# Altium project 8SoundsUSB.PrjPCB (part 1 of 2)
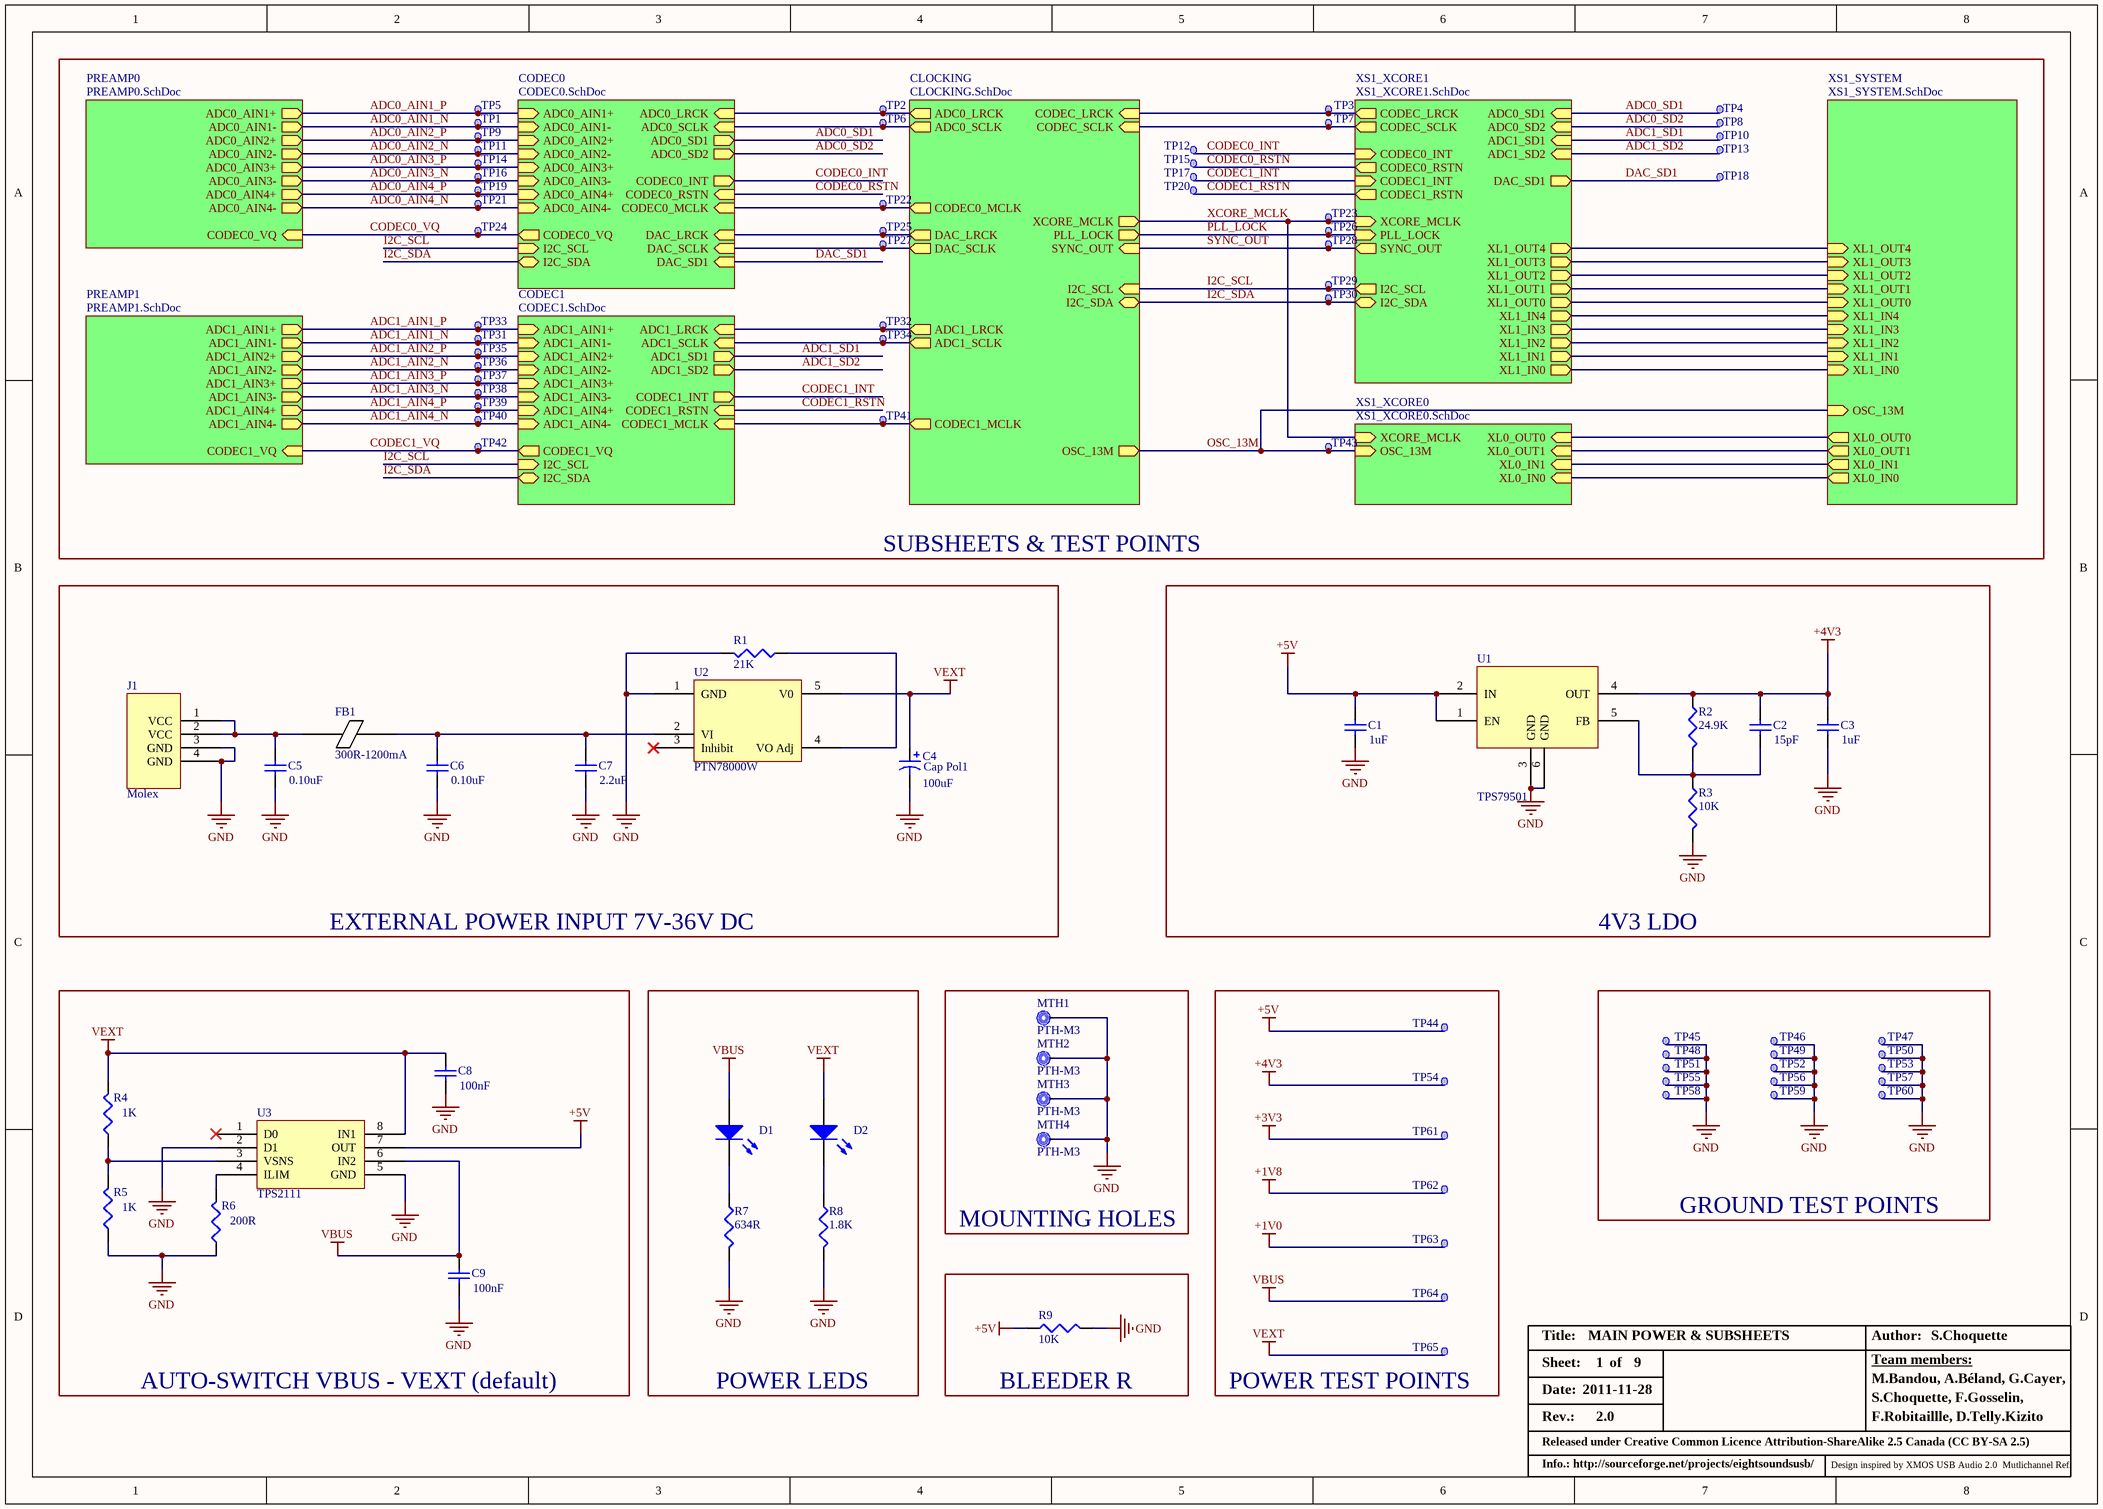
[diagram p0: MAIN_POWER.SchDoc]
9 sheets, 415 parts. Net scope: hierarchical (ports join the sheet entries above them; power ports are global).
Board file: 8SoundsUSB.PcbDoc
Sheets:
  MAIN_POWER.SchDoc
    CLOCKING = CLOCKING.SchDoc
    CODEC0 = CODEC0.SchDoc
    CODEC1 = CODEC1.SchDoc
    PREAMP0 = PREAMP0.SchDoc
    PREAMP1 = PREAMP1.SchDoc
    XS1_SYSTEM = XS1_SYSTEM.SchDoc
    XS1_XCORE0 = XS1_XCORE0.SchDoc
    XS1_XCORE1 = XS1_XCORE1.SchDoc

## Sheet MAIN_POWER.SchDoc: MAIN POWER & SUBSHEETS
size A3; Date: 2011-11-28; Author: S.Choquette; Revision: 2.0; SheetNumber: 1; SheetTotal: 9

### Parts
C1  value 1uF  [3-0603]
C2  value 15pF  [3-0603]
C3  value 1uF  [3-0603]
C4  Cap Pol1  value 100uF  [AL_ELEC_SMD_D]
C5  value 0.10uF  [3-0603]
C6  value 0.10uF  [3-0603]
C7  value 2.2uF  [8-1206]
C8  value 100nF  [3-0603]
C9  value 100nF  [3-0603]
D1  VBUS  [LED_0603]  (value not drawn)
D2  VEXT  [LED_0603]  (value not drawn)
FB1  300R-1200mA  [3-0603]
J1  Molex  [MOLEX-P4]
MTH1  PTH-M3  [Mounting Hole]
MTH2  PTH-M3  [Mounting Hole]
MTH3  PTH-M3  [Mounting Hole]
MTH4  PTH-M3  [Mounting Hole]
R1  value 21K  [3-0603]
R2  value 24.9K  [3-0603]
R3  value 10K  [3-0603]
R4  value 1K  [3-0603]
R5  value 1K  [3-0603]
R6  value 200R  [3-0603]
R7  value 634R  [3-0603]
R8  value 1.8K  [3-0603]
R9  value 10K  [3-0603]
TP1  TP  [TP]  (value not drawn)
TP2  TP  [TP]  (value not drawn)
TP3  TP  [TP]  (value not drawn)
TP4  TP  [TP]  (value not drawn)
TP5  TP  [TP]  (value not drawn)
TP6  TP  [TP]  (value not drawn)
TP7  TP  [TP]  (value not drawn)
TP8  TP  [TP]  (value not drawn)
TP9  TP  [TP]  (value not drawn)
TP10  TP  [TP]  (value not drawn)
TP11  TP  [TP]  (value not drawn)
TP12  TP  [TP]  (value not drawn)
TP13  TP  [TP]  (value not drawn)
TP14  TP  [TP]  (value not drawn)
TP15  TP  [TP]  (value not drawn)
TP16  TP  [TP]  (value not drawn)
TP17  TP  [TP]  (value not drawn)
TP18  TP  [TP]  (value not drawn)
TP19  TP  [TP]  (value not drawn)
TP20  TP  [TP]  (value not drawn)
TP21  TP  [TP]  (value not drawn)
TP22  TP  [TP]  (value not drawn)
TP23  TP  [TP]  (value not drawn)
TP24  TP  [TP]  (value not drawn)
TP25  TP  [TP]  (value not drawn)
TP26  TP  [TP]  (value not drawn)
TP27  TP  [TP]  (value not drawn)
TP28  TP  [TP]  (value not drawn)
TP29  TP  [TP]  (value not drawn)
TP30  TP  [TP]  (value not drawn)
TP31  TP  [TP]  (value not drawn)
TP32  TP  [TP]  (value not drawn)
TP33  TP  [TP]  (value not drawn)
TP34  TP  [TP]  (value not drawn)
TP35  TP  [TP]  (value not drawn)
TP36  TP  [TP]  (value not drawn)
TP37  TP  [TP]  (value not drawn)
TP38  TP  [TP]  (value not drawn)
TP39  TP  [TP]  (value not drawn)
TP40  TP  [TP]  (value not drawn)
TP41  TP  [TP]  (value not drawn)
TP42  TP  [TP]  (value not drawn)
TP43  TP  [TP]  (value not drawn)
TP44  TP  [TP]  (value not drawn)
TP45  TP  [TP]  (value not drawn)
TP46  TP  [TP]  (value not drawn)
TP47  TP  [TP]  (value not drawn)
TP48  TP  [TP]  (value not drawn)
TP49  TP  [TP]  (value not drawn)
TP50  TP  [TP]  (value not drawn)
TP51  TP  [TP]  (value not drawn)
TP52  TP  [TP]  (value not drawn)
TP53  TP  [TP]  (value not drawn)
TP54  TP  [TP]  (value not drawn)
TP55  TP  [TP]  (value not drawn)
TP56  TP  [TP]  (value not drawn)
TP57  TP  [TP]  (value not drawn)
TP58  TP  [TP]  (value not drawn)
TP59  TP  [TP]  (value not drawn)
TP60  TP  [TP]  (value not drawn)
TP61  TP  [TP]  (value not drawn)
TP62  TP  [TP]  (value not drawn)
TP63  TP  [TP]  (value not drawn)
TP64  TP  [TP]  (value not drawn)
TP65  TP  [TP]  (value not drawn)
U1  TPS79501  [SOT223-6L]
U2  PTN78000W  [PTN78000W]
U3  TPS2111  [TSOP65P640-8AL]

### Blocks framed on the sheet
SUBSHEETS & TEST POINTS: TP1-TP43
EXTERNAL POWER INPUT 7V-36V DC: C4-C7 FB1 J1 R1 U2
4V3 LDO: C1-C3 R2 R3 U1
AUTO-SWITCH VBUS - VEXT (default): C8 C9 R4-R6 U3
POWER LEDS: D1 D2 R7 R8
MOUNTING HOLES: MTH1-MTH4
POWER TEST POINTS: TP44 TP54 TP61-TP65
GROUND TEST POINTS: TP45-TP53 TP55-TP60
BLEEDER R: R9

### Sub-sheets
CLOCKING = CLOCKING.SchDoc: SYNC_OUT (in), CODEC0_MCLK (out), CODEC1_MCLK (out), I2C_SCL (in), I2C_SDA (bidir), PLL_LOCK (out), OSC_13M (out), CODEC_LRCK (in), CODEC_SCLK (in), ADC0_SCLK (out), ADC0_LRCK (out), DAC_SCLK (out), DAC_LRCK (out), XCORE_MCLK (out), ADC1_LRCK (out), ADC1_SCLK (out)
CODEC0 = CODEC0.SchDoc: ADC0_AIN1+ (in), ADC0_AIN1- (in), ADC0_AIN2+ (in), ADC0_AIN2- (in), ADC0_AIN3+ (in), ADC0_AIN3- (in), ADC0_AIN4+ (in), ADC0_AIN4- (in), CODEC0_VQ (out), ADC0_LRCK (in), ADC0_SCLK (in), ADC0_SD1 (out), ADC0_SD2 (out), CODEC0_INT (out), CODEC0_RSTN (in), CODEC0_MCLK (in), DAC_LRCK (in), DAC_SCLK (in), DAC_SD1 (in), I2C_SCL (in), I2C_SDA
CODEC1 = CODEC1.SchDoc: ADC1_AIN1+ (in), ADC1_AIN1- (in), ADC1_AIN2+ (in), ADC1_AIN2- (in), ADC1_AIN3+ (in), ADC1_AIN3- (in), ADC1_AIN4+ (in), ADC1_AIN4- (in), CODEC1_VQ (out), ADC1_LRCK (in), ADC1_SCLK (in), ADC1_SD1 (out), ADC1_SD2 (out), CODEC1_INT (out), CODEC1_RSTN (in), CODEC1_MCLK (in), I2C_SCL (in), I2C_SDA (bidir)
PREAMP0 = PREAMP0.SchDoc: ADC0_AIN1+ (out), ADC0_AIN1- (out), ADC0_AIN2+ (out), ADC0_AIN2- (out), ADC0_AIN3+ (out), ADC0_AIN3- (out), ADC0_AIN4+ (out), ADC0_AIN4- (out), CODEC0_VQ (in)
PREAMP1 = PREAMP1.SchDoc: ADC1_AIN1+ (out), ADC1_AIN1- (out), ADC1_AIN2+ (out), ADC1_AIN2- (out), ADC1_AIN3+ (out), ADC1_AIN3- (out), ADC1_AIN4+ (out), ADC1_AIN4- (out), CODEC1_VQ (in)
XS1_SYSTEM = XS1_SYSTEM.SchDoc: XL0_OUT1 (out), XL0_OUT0 (out), XL0_IN0 (out), XL0_IN1 (out), XL1_OUT4 (in), XL1_OUT3 (in), XL1_OUT2 (in), XL1_OUT1 (in), XL1_OUT0 (in), XL1_IN4 (in), XL1_IN3 (in), XL1_IN2 (in), XL1_IN1 (in), XL1_IN0 (in), OSC_13M (in)
XS1_XCORE0 = XS1_XCORE0.SchDoc: XL0_IN0 (in), XL0_IN1 (in), XL0_OUT1 (in), XL0_OUT0 (in), OSC_13M (in), XCORE_MCLK (in)
XS1_XCORE1 = XS1_XCORE1.SchDoc: CODEC_LRCK (out), CODEC_SCLK (out), CODEC0_INT (in), CODEC0_RSTN (out), CODEC1_INT (in), CODEC1_RSTN (out), XCORE_MCLK (in), PLL_LOCK (in), SYNC_OUT (out), ADC0_SD1 (in), ADC0_SD2 (in), ADC1_SD1 (in), ADC1_SD2 (in), DAC_SD1 (out), I2C_SCL (out), I2C_SDA (bidir), XL1_OUT4 (out), XL1_OUT3 (out), XL1_OUT2 (out), XL1_OUT1 (out), XL1_OUT0 (out), XL1_IN4 (out), XL1_IN3 (out), XL1_IN2 (out), XL1_IN1 (out), XL1_IN0 (out)

### Nets
+1V0: TP63.1
+1V8: TP62.1
+3V3: TP61.1
+4V3: C2.2 C3.2 R2.1 TP54.1 U1.4(OUT)
+5V: C1.2 R9.1 TP44.1 U1.1(EN) U1.2(IN) U3.7(OUT)
GND: C1.1 C3.1 C4.2 C5.1 C6.1 C7.1 C8.1 C9.1 J1.3(GND) J1.4(GND) MTH1.1 MTH2.1 MTH3.1 MTH4.1 R1.2 R3.2 R5.1 R6.1 R7.2 R8.2 R9.2 TP45.1 TP46.1 TP47.1 TP48.1 TP49.1 TP50.1 TP51.1 TP52.1 TP53.1 TP55.1 TP56.1 TP57.1 TP58.1 TP59.1 TP60.1 U1.3(GND) U1.6(GND) U2.1(GND) U3.2(D1) U3.5(GND)
VBUS: C9.2 D1.1(A) TP64.1 U3.6(IN2)
VEXT: C4.1 C8.2 D2.1(A) R4.2 TP65.1 U2.5(V0) U3.8(IN1)
ADC0_AIN1_N: TP1.1 ; sheet CODEC0/ADC0_AIN1-, sheet PREAMP0/ADC0_AIN1-
ADC0_AIN1_P: TP5.1 ; sheet CODEC0/ADC0_AIN1+, sheet PREAMP0/ADC0_AIN1+
ADC0_AIN2_N: TP11.1 ; sheet CODEC0/ADC0_AIN2-, sheet PREAMP0/ADC0_AIN2-
ADC0_AIN2_P: TP9.1 ; sheet CODEC0/ADC0_AIN2+, sheet PREAMP0/ADC0_AIN2+
ADC0_AIN3_N: TP16.1 ; sheet CODEC0/ADC0_AIN3-, sheet PREAMP0/ADC0_AIN3-
ADC0_AIN3_P: TP14.1 ; sheet CODEC0/ADC0_AIN3+, sheet PREAMP0/ADC0_AIN3+
ADC0_AIN4_N: TP21.1 ; sheet CODEC0/ADC0_AIN4-, sheet PREAMP0/ADC0_AIN4-
ADC0_AIN4_P: TP19.1 ; sheet CODEC0/ADC0_AIN4+, sheet PREAMP0/ADC0_AIN4+
ADC0_SD1: TP4.1 ; sheet CODEC0/ADC0_SD1, sheet XS1_XCORE1/ADC0_SD1
ADC0_SD2: TP8.1 ; sheet CODEC0/ADC0_SD2, sheet XS1_XCORE1/ADC0_SD2
ADC1_AIN1_N: TP31.1 ; sheet CODEC1/ADC1_AIN1-, sheet PREAMP1/ADC1_AIN1-
ADC1_AIN1_P: TP33.1 ; sheet CODEC1/ADC1_AIN1+, sheet PREAMP1/ADC1_AIN1+
ADC1_AIN2_N: TP36.1 ; sheet CODEC1/ADC1_AIN2-, sheet PREAMP1/ADC1_AIN2-
ADC1_AIN2_P: TP35.1 ; sheet CODEC1/ADC1_AIN2+, sheet PREAMP1/ADC1_AIN2+
ADC1_AIN3_N: TP38.1 ; sheet CODEC1/ADC1_AIN3-, sheet PREAMP1/ADC1_AIN3-
ADC1_AIN3_P: TP37.1 ; sheet CODEC1/ADC1_AIN3+, sheet PREAMP1/ADC1_AIN3+
ADC1_AIN4_N: TP40.1 ; sheet CODEC1/ADC1_AIN4-, sheet PREAMP1/ADC1_AIN4-
ADC1_AIN4_P: TP39.1 ; sheet CODEC1/ADC1_AIN4+, sheet PREAMP1/ADC1_AIN4+
ADC1_SD1: TP10.1 ; sheet CODEC1/ADC1_SD1, sheet XS1_XCORE1/ADC1_SD1
ADC1_SD2: TP13.1 ; sheet CODEC1/ADC1_SD2, sheet XS1_XCORE1/ADC1_SD2
CODEC0_INT: TP12.1 ; sheet CODEC0/CODEC0_INT, sheet XS1_XCORE1/CODEC0_INT
CODEC0_RSTN: TP15.1 ; sheet CODEC0/CODEC0_RSTN, sheet XS1_XCORE1/CODEC0_RSTN
CODEC0_VQ: TP24.1 ; sheet CODEC0/CODEC0_VQ, sheet PREAMP0/CODEC0_VQ
CODEC1_INT: TP17.1 ; sheet CODEC1/CODEC1_INT, sheet XS1_XCORE1/CODEC1_INT
CODEC1_RSTN: TP20.1 ; sheet CODEC1/CODEC1_RSTN, sheet XS1_XCORE1/CODEC1_RSTN
CODEC1_VQ: TP42.1 ; sheet CODEC1/CODEC1_VQ, sheet PREAMP1/CODEC1_VQ
DAC_SD1: TP18.1 ; sheet CODEC0/DAC_SD1, sheet XS1_XCORE1/DAC_SD1
I2C_SCL: TP29.1 ; sheet CLOCKING/I2C_SCL, sheet CODEC0/I2C_SCL, sheet CODEC1/I2C_SCL, sheet XS1_XCORE1/I2C_SCL
I2C_SDA: TP30.1 ; sheet CLOCKING/I2C_SDA, sheet CODEC0/I2C_SDA, sheet CODEC1/I2C_SDA, sheet XS1_XCORE1/I2C_SDA
OSC_13M: TP43.1 ; sheet CLOCKING/OSC_13M, sheet XS1_SYSTEM/OSC_13M, sheet XS1_XCORE0/OSC_13M
PLL_LOCK: TP26.1 ; sheet CLOCKING/PLL_LOCK, sheet XS1_XCORE1/PLL_LOCK
SYNC_OUT: TP28.1 ; sheet CLOCKING/SYNC_OUT, sheet XS1_XCORE1/SYNC_OUT
XCORE_MCLK: TP23.1 ; sheet CLOCKING/XCORE_MCLK, sheet XS1_XCORE0/XCORE_MCLK, sheet XS1_XCORE1/XCORE_MCLK
XL0_IN0: sheet XS1_SYSTEM/XL0_IN0, sheet XS1_XCORE0/XL0_IN0
XL0_IN1: sheet XS1_SYSTEM/XL0_IN1, sheet XS1_XCORE0/XL0_IN1
XL0_OUT0: sheet XS1_SYSTEM/XL0_OUT0, sheet XS1_XCORE0/XL0_OUT0
XL0_OUT1: sheet XS1_SYSTEM/XL0_OUT1, sheet XS1_XCORE0/XL0_OUT1
NetC2_1: C2.1 R2.2 R3.1 U1.5(FB)
NetC5_2: C5.2 FB1.2 J1.1(VCC) J1.2(VCC)
NetC6_2: C6.2 C7.2 FB1.1 U2.2(VI)
NetD1_2: D1.2(K) R7.1
NetD2_2: D2.2(K) R8.1
NetJ3_2: sheet XS1_SYSTEM/XL1_OUT4, sheet XS1_XCORE1/XL1_OUT4
NetJ3_4: sheet XS1_SYSTEM/XL1_OUT3, sheet XS1_XCORE1/XL1_OUT3
NetJ3_6: sheet XS1_SYSTEM/XL1_OUT1, sheet XS1_XCORE1/XL1_OUT1
NetJ3_8: sheet XS1_SYSTEM/XL1_OUT2, sheet XS1_XCORE1/XL1_OUT2
NetJ3_10: sheet XS1_SYSTEM/XL1_OUT0, sheet XS1_XCORE1/XL1_OUT0
NetJ3_12: sheet XS1_SYSTEM/XL1_IN2, sheet XS1_XCORE1/XL1_IN2
NetJ3_14: sheet XS1_SYSTEM/XL1_IN0, sheet XS1_XCORE1/XL1_IN0
NetJ3_16: sheet XS1_SYSTEM/XL1_IN3, sheet XS1_XCORE1/XL1_IN3
NetJ3_18: sheet XS1_SYSTEM/XL1_IN1, sheet XS1_XCORE1/XL1_IN1
NetJ3_20: sheet XS1_SYSTEM/XL1_IN4, sheet XS1_XCORE1/XL1_IN4
NetR1_1: R1.1 U2.4(VO_Adj)
NetR4_1: R4.1 R5.2 U3.3(VSNS)
NetR6_2: R6.2 U3.4(ILIM)
NetR42_1: TP22.1 ; sheet CLOCKING/CODEC0_MCLK, sheet CODEC0/CODEC0_MCLK
NetR43_1: TP41.1 ; sheet CLOCKING/CODEC1_MCLK, sheet CODEC1/CODEC1_MCLK
NetR46_1: TP6.1 ; sheet CLOCKING/ADC0_SCLK, sheet CODEC0/ADC0_SCLK
NetR47_1: TP34.1 ; sheet CLOCKING/ADC1_SCLK, sheet CODEC1/ADC1_SCLK
NetR48_1: TP27.1 ; sheet CLOCKING/DAC_SCLK, sheet CODEC0/DAC_SCLK
NetR49_1: TP2.1 ; sheet CLOCKING/ADC0_LRCK, sheet CODEC0/ADC0_LRCK
NetR50_1: TP32.1 ; sheet CLOCKING/ADC1_LRCK, sheet CODEC1/ADC1_LRCK
NetR51_1: TP25.1 ; sheet CLOCKING/DAC_LRCK, sheet CODEC0/DAC_LRCK
NetTP3_1: TP3.1 ; sheet CLOCKING/CODEC_LRCK, sheet XS1_XCORE1/CODEC_LRCK
NetTP7_1: TP7.1 ; sheet CLOCKING/CODEC_SCLK, sheet XS1_XCORE1/CODEC_SCLK

Not connected (* = marked no-connect by the designer): U2 3(Inhibit)*; U3 1(D0)*

### Notes on the sheet
- Title:
- Date:
- Sheet:
- of
- Author:
- Team members:
- M.Bandou, A.Béland, G.Cayer,
- Rev.:
- Released under Creative Common Licence Attribution-ShareAlike 2.5 Canada (CC BY-SA 2.5)
- S.Choquette, F.Gosselin,
- F.Robitaillle, D.Telly.Kizito
- Info.: http://sourceforge.net/projects/eightsoundsusb/
- Design inspired by XMOS USB Audio 2.0  Mutlichannel Ref.

### Library data of the parts
C1 C3 = Cap: MLCC 1uF 0603 X5R 10V; Manufacturer: Murata; Part Number: GRM188R61A105KA61; Cost: 0,005
C2 = Cap: MLCC 15pF 0603 C0G 50V; Manufacturer: Murata; Part Number: GRM1885C1H150JA01D; Cost: 0,005
C4 = Cap Pol1: Al Elec 100uF CaseD 16V; Manufacturer: Panasonic; Part Number: EEEFK1C101P; Cost: *
C5 C6 = Cap: MLCC 0.10uF 0603 X7R 50V; Manufacturer: Murata; Part Number: GRM188R71H104KA93D; Cost: 0,005
C7 = Cap: MLCC 2.2uF 1206 X7R 50V; Manufacturer: Murata; Part Number: GRM31CR71H225KA88L
C8 C9 = Cap: MLCC 100nF 0603 X7R 16V; Manufacturer: Murata; Part Number: GRM188R71C104KA01; Cost: 0,005
D1 D2 = LED2: LED, GREEN, 0603; Manufacturer: Kingbright; Part Number: APT1608CGCK; Publisher: Altium Limited
FB1 = 300R-1200mA: Ferrite 300R -1200mA; Part Number: BLM18SG331TN1D; Manufacturer: Murata
J1 = Component_1: Molex connector; Part Number: 0026013115; Manufacturer: Molex
MTH1-MTH4 = MountingHole
R1 = Res3: RES 21k 0603 1%; Manufacturer: ROHM; PArt Number: MCR03EZPFX2102; Cost: *
R2 = Res3: RES 24.9K 0603 1%; Manufacturer: ROHM; Part Number: MCR03EZPFX2493; Cost: *
R3 R9 = Res3: RES 10k 0603 1%; Manufacturer: ROHM; Part Number: MCR03EZPFX1002; Cost: *
R4 R5 = Res3: RES 1k 0603 1%; Manufacturer: ROHM; Part Number: MCR03EZPFX1001; Cost: *
R6 = Res3: RES 200R 0603 1%; Manufacturer: ROHM; PArt Number: MCR03EZPFX2000; Cost: *
R7 = Res3: RES 634R 0603 1%; Manufacturer: ROHM; Part Number: MCR03EZPFX6340; Cost: *
R8 = Res3: RES 1.8k 0603 1%; Manufacturer: ROHM; Part Number: MCR03EZPFX1801; Cost: *
U1 = TPS79501: ULTRALOW-NOISE, HIGH PSRR, FAST RF 500-mA LOW-DROPOUT LINEAR REGULATORS; Manufacturer: Texas instruments; Part Number: TPS79501DCQ
U2 = PTN78000: 1.5-A, Wide-Input Adjustable Switching Regulator; Manufacturer: Texas Instrument; Part Number: PTN78000W; Cost: *
U3 = TPS2111: Dual In/Single Out Autoswitching Power MUX; Manufacturer: Texas Instrument; Part Number: TPS2111; Cost: *

## Sheet CLOCKING.SchDoc: CLOCKING
size A3; Date: 2011-11-28; Author: S.Choquette; Revision: 2.0; SheetNumber: 5; SheetTotal: 9
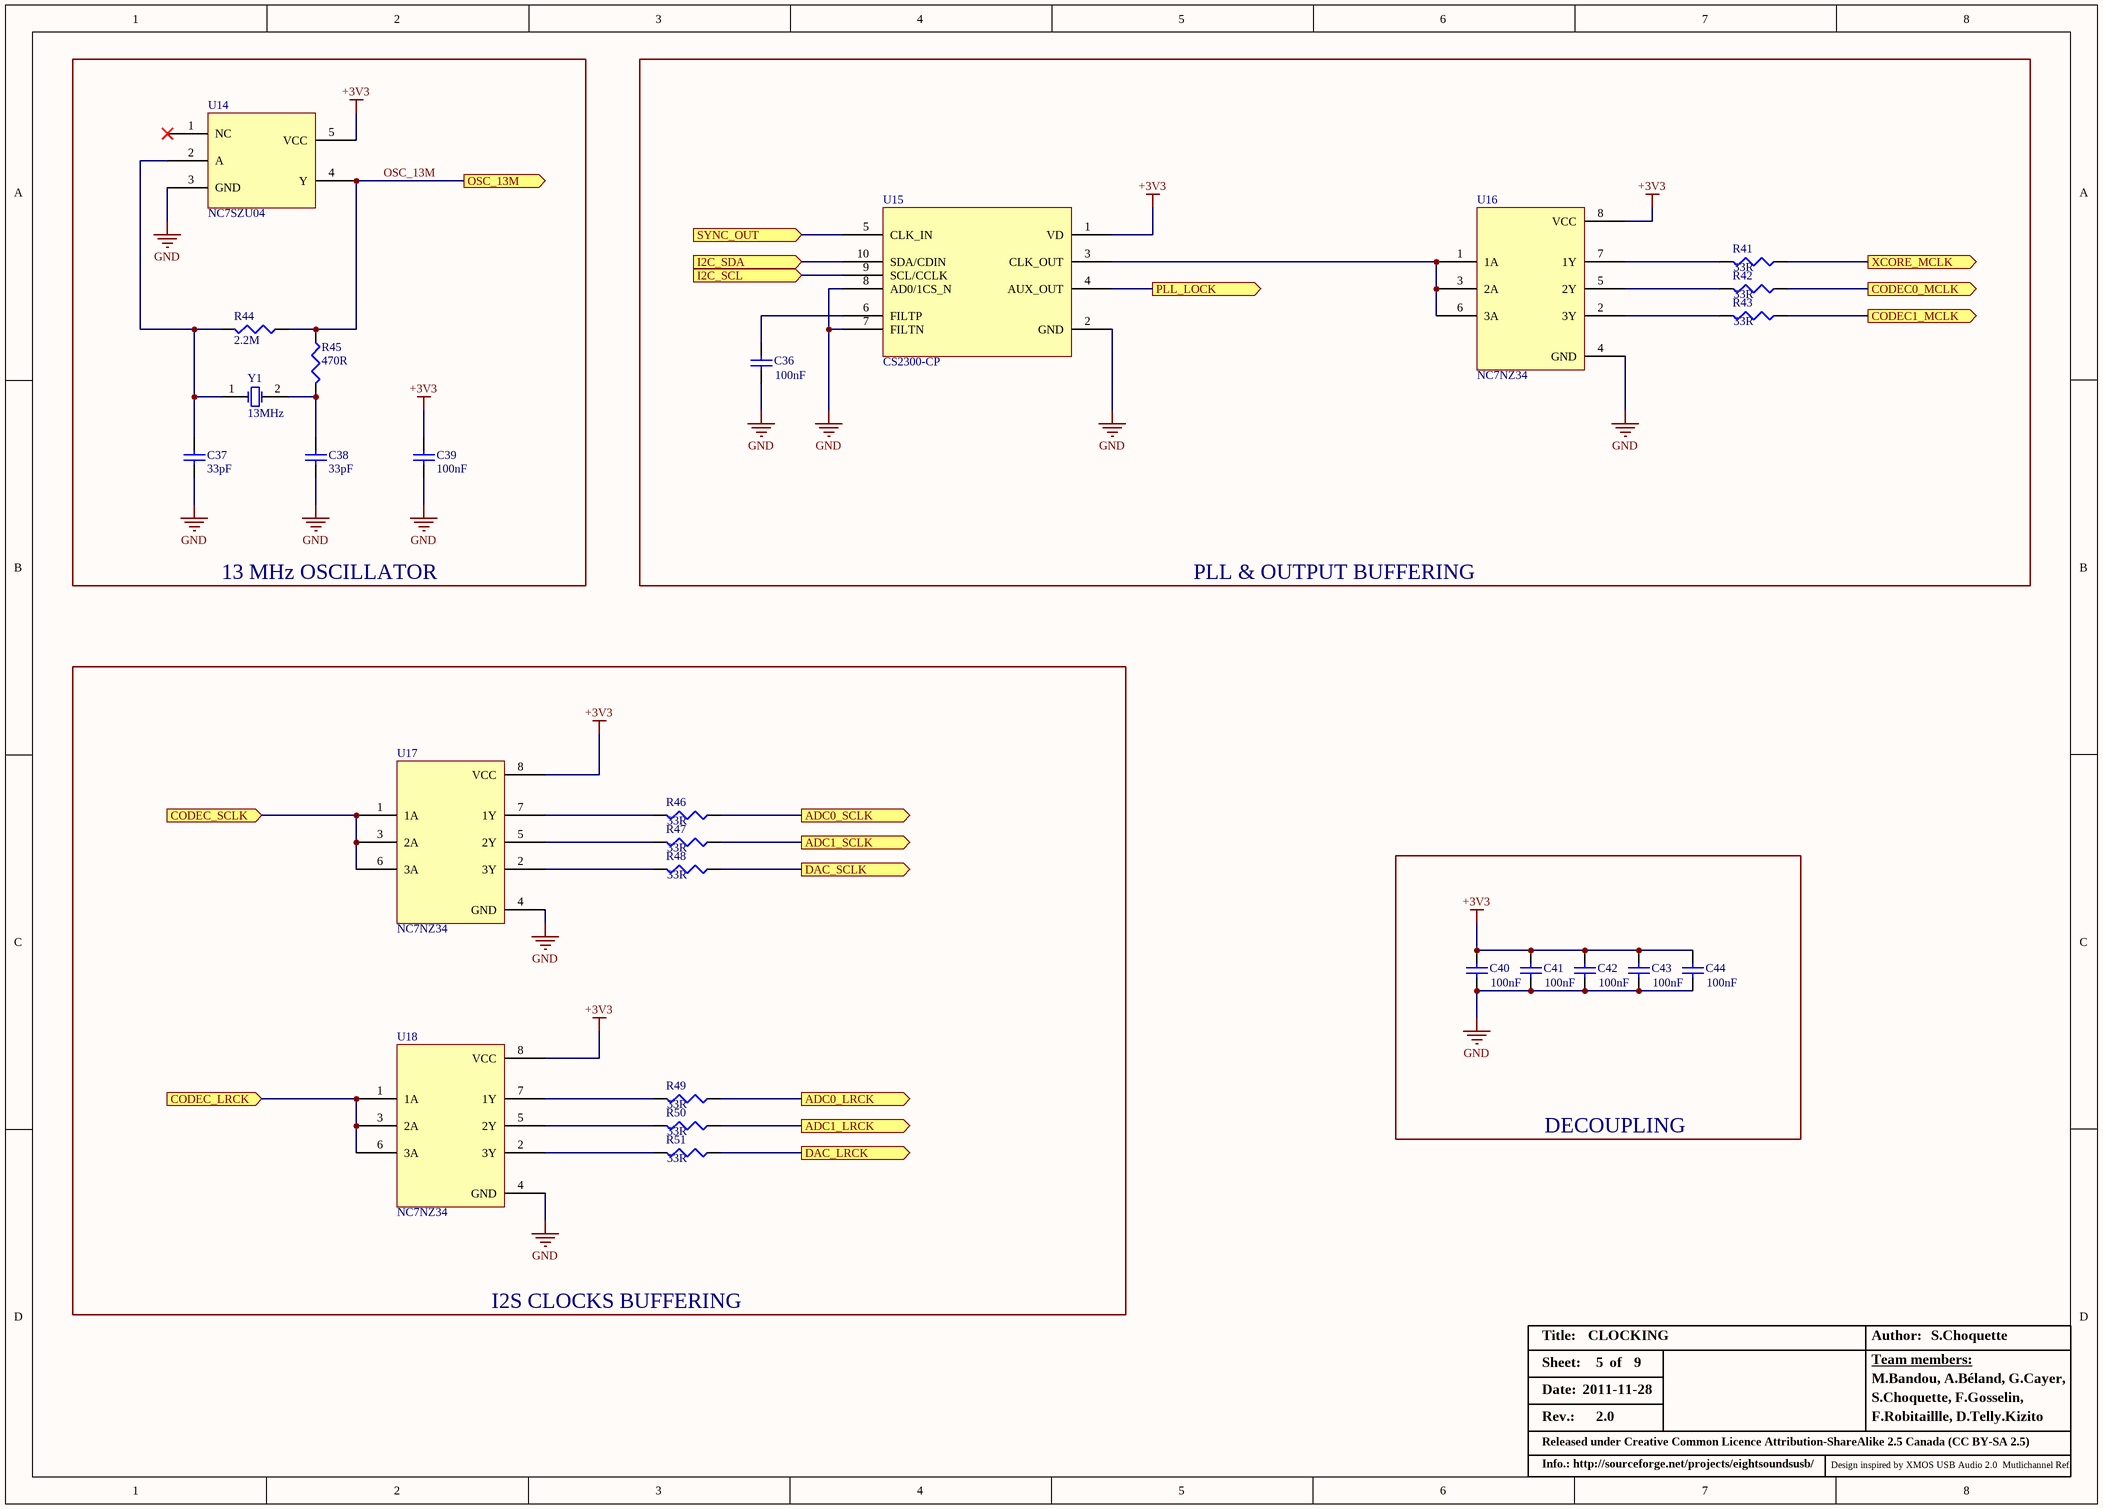
[diagram p1: CLOCKING.SchDoc]

### Parts
C36  value 100nF  [2-0402]
C37  value 33pF  [3-0603]
C38  value 33pF  [3-0603]
C39  value 100nF  [3-0603]
C40  value 100nF  [2-0402]
C41  value 100nF  [2-0402]
C42  value 100nF  [2-0402]
C43  value 100nF  [2-0402]
C44  value 100nF  [2-0402]
R41  value 33R  [3-0603]
R42  value 33R  [3-0603]
R43  value 33R  [3-0603]
R44  value 2.2M  [3-0603]
R45  value 470R  [3-0603]
R46  value 33R  [3-0603]
R47  value 33R  [3-0603]
R48  value 33R  [3-0603]
R49  value 33R  [3-0603]
R50  value 33R  [3-0603]
R51  value 33R  [3-0603]
U14  NC7SZU04  [SOT23-5AL_MOD(1-07-26)]
U15  CS2300-CP  [TSSOP50P490-10AL]
U16  NC7NZ34  [NC7NZ34]
U17  NC7NZ34  [NC7NZ34]
U18  NC7NZ34  [NC7NZ34]
Y1  13MHz  [X_TAL]

### Blocks framed on the sheet
13 MHz OSCILLATOR: C37-C39 R44 R45 U14 Y1
PLL & OUTPUT BUFFERING: C36 R41-R43 U15 U16
I2S CLOCKS BUFFERING: R46-R51 U17 U18
DECOUPLING: C40-C44

### Ports
ADC0_LRCK (out), ADC0_SCLK (out), ADC1_LRCK (out), ADC1_SCLK (out), CODEC0_MCLK (out), CODEC1_MCLK (out), CODEC_LRCK (in), CODEC_SCLK (in), DAC_LRCK (out), DAC_SCLK (out), I2C_SCL (in), I2C_SDA (in), OSC_13M (out), PLL_LOCK (out), SYNC_OUT (in), XCORE_MCLK (out)

### Nets
+3V3: C39.2 C40.2 C41.2 C42.2 C43.2 C44.2 U14.5(VCC) U15.1(VD) U16.8(VCC) U17.8(VCC) U18.8(VCC)
GND: C36.1 C37.1 C38.1 C39.1 C40.1 C41.1 C42.1 C43.1 C44.1 U14.3(GND) U15.2(GND) U15.7(FILTN) U15.8(AD0/1CS_N) U16.4(GND) U17.4(GND) U18.4(GND)
I2C_SCL: U15.9(SCL/CCLK) ; port I2C_SCL
I2C_SDA: U15.10(SDA/CDIN) ; port I2C_SDA
OSC_13M: R44.1 R45.1 U14.4(Y) ; port OSC_13M
PLL_LOCK: U15.4(AUX_OUT) ; port PLL_LOCK
SYNC_OUT: U15.5(CLK_IN) ; port SYNC_OUT
XCORE_MCLK: R41.1 ; port XCORE_MCLK
NetC36_2: C36.2 U15.6(FILTP)
NetC37_2: C37.2 R44.2 U14.2(A) Y1.1(OSC1)
NetC38_2: C38.2 R45.2 Y1.2(OSC2)
NetR41_2: R41.2 U16.7(1Y)
NetR42_1: R42.1 ; port CODEC0_MCLK
NetR42_2: R42.2 U16.5(2Y)
NetR43_1: R43.1 ; port CODEC1_MCLK
NetR43_2: R43.2 U16.2(3Y)
NetR46_1: R46.1 ; port ADC0_SCLK
NetR46_2: R46.2 U17.7(1Y)
NetR47_1: R47.1 ; port ADC1_SCLK
NetR47_2: R47.2 U17.5(2Y)
NetR48_1: R48.1 ; port DAC_SCLK
NetR48_2: R48.2 U17.2(3Y)
NetR49_1: R49.1 ; port ADC0_LRCK
NetR49_2: R49.2 U18.7(1Y)
NetR50_1: R50.1 ; port ADC1_LRCK
NetR50_2: R50.2 U18.5(2Y)
NetR51_1: R51.1 ; port DAC_LRCK
NetR51_2: R51.2 U18.2(3Y)
NetTP3_1: U18.1(1A) U18.3(2A) U18.6(3A) ; port CODEC_LRCK
NetTP7_1: U17.1(1A) U17.3(2A) U17.6(3A) ; port CODEC_SCLK
NetU15_3: U15.3(CLK_OUT) U16.1(1A) U16.3(2A) U16.6(3A)

Not connected (* = marked no-connect by the designer): U14 1(NC)*

### Notes on the sheet
- Title:
- Date:
- Sheet:
- of
- Author:
- Team members:
- M.Bandou, A.Béland, G.Cayer,
- Rev.:
- Released under Creative Common Licence Attribution-ShareAlike 2.5 Canada (CC BY-SA 2.5)
- S.Choquette, F.Gosselin,
- F.Robitaillle, D.Telly.Kizito
- Info.: http://sourceforge.net/projects/eightsoundsusb/
- Design inspired by XMOS USB Audio 2.0  Mutlichannel Ref.

### Library data of the parts
C36 C40-C44 = Cap: MLCC 100nF 0402 X7R 16V; Manufacturer: Murata; Part Number: GRM155R71C104KA88; Cost: 0,005
C37 C38 = Cap: MLCC 33pF 0603 COG 50V; Manufacturer: Murata; Part Number: GRM1885C1H330JA01; Cost: 0,005
C39 = Cap: as C8 on sheet MAIN_POWER; Cost: 0,005
R41-R43 R46-R51 = Res3: RES 33R 0603 1%; Manufacturer: ROHM; Part Number: MCR03EZPFX33R0; Cost: *
R44 = Res3: RES 2.2M 0603 5%; Manufacturer: ROHM; Part Number: MCR03EZPJ225; Cost: *
R45 = Res3: RES 470R 0603 1%; Manufacturer: ROHM; Part Number: MCR03EZPFX4700; Cost: *
U14 = NC7SZU04: TinyLogic UHS Unbuffered Inverter; Manufacturer: Fairchild; Part Number: NC7SZU04M5X; Cost: *
U15 = CS2300-CP: Fractional-N Clock Multiplier with Internal LCO; Manufacturer: Cirrus Logic; Part Number: CS2300-CP; Cost: *
U16-U18 = NC7NZ34: TinyLogic UHS Triple Buffer; Part Number: NC7NZ34K8X; Manufacturer: Fairchild; Cost: *
Y1 = XTAL: Crystal, 13MHz, HC49/US SMD, Fundamental, 18pF, Tol. ±30ppm, Stab. ±30ppm; Manufacturer: Abracon; Part Number: ABLS2-13.000MHz-D4Y; Cost: *

## Sheet CODEC0.SchDoc: CODEC 0
size A3; Date: 2011-11-28; Author: S.Choquette; Revision: 2.0; SheetNumber: 6; SheetTotal: 9
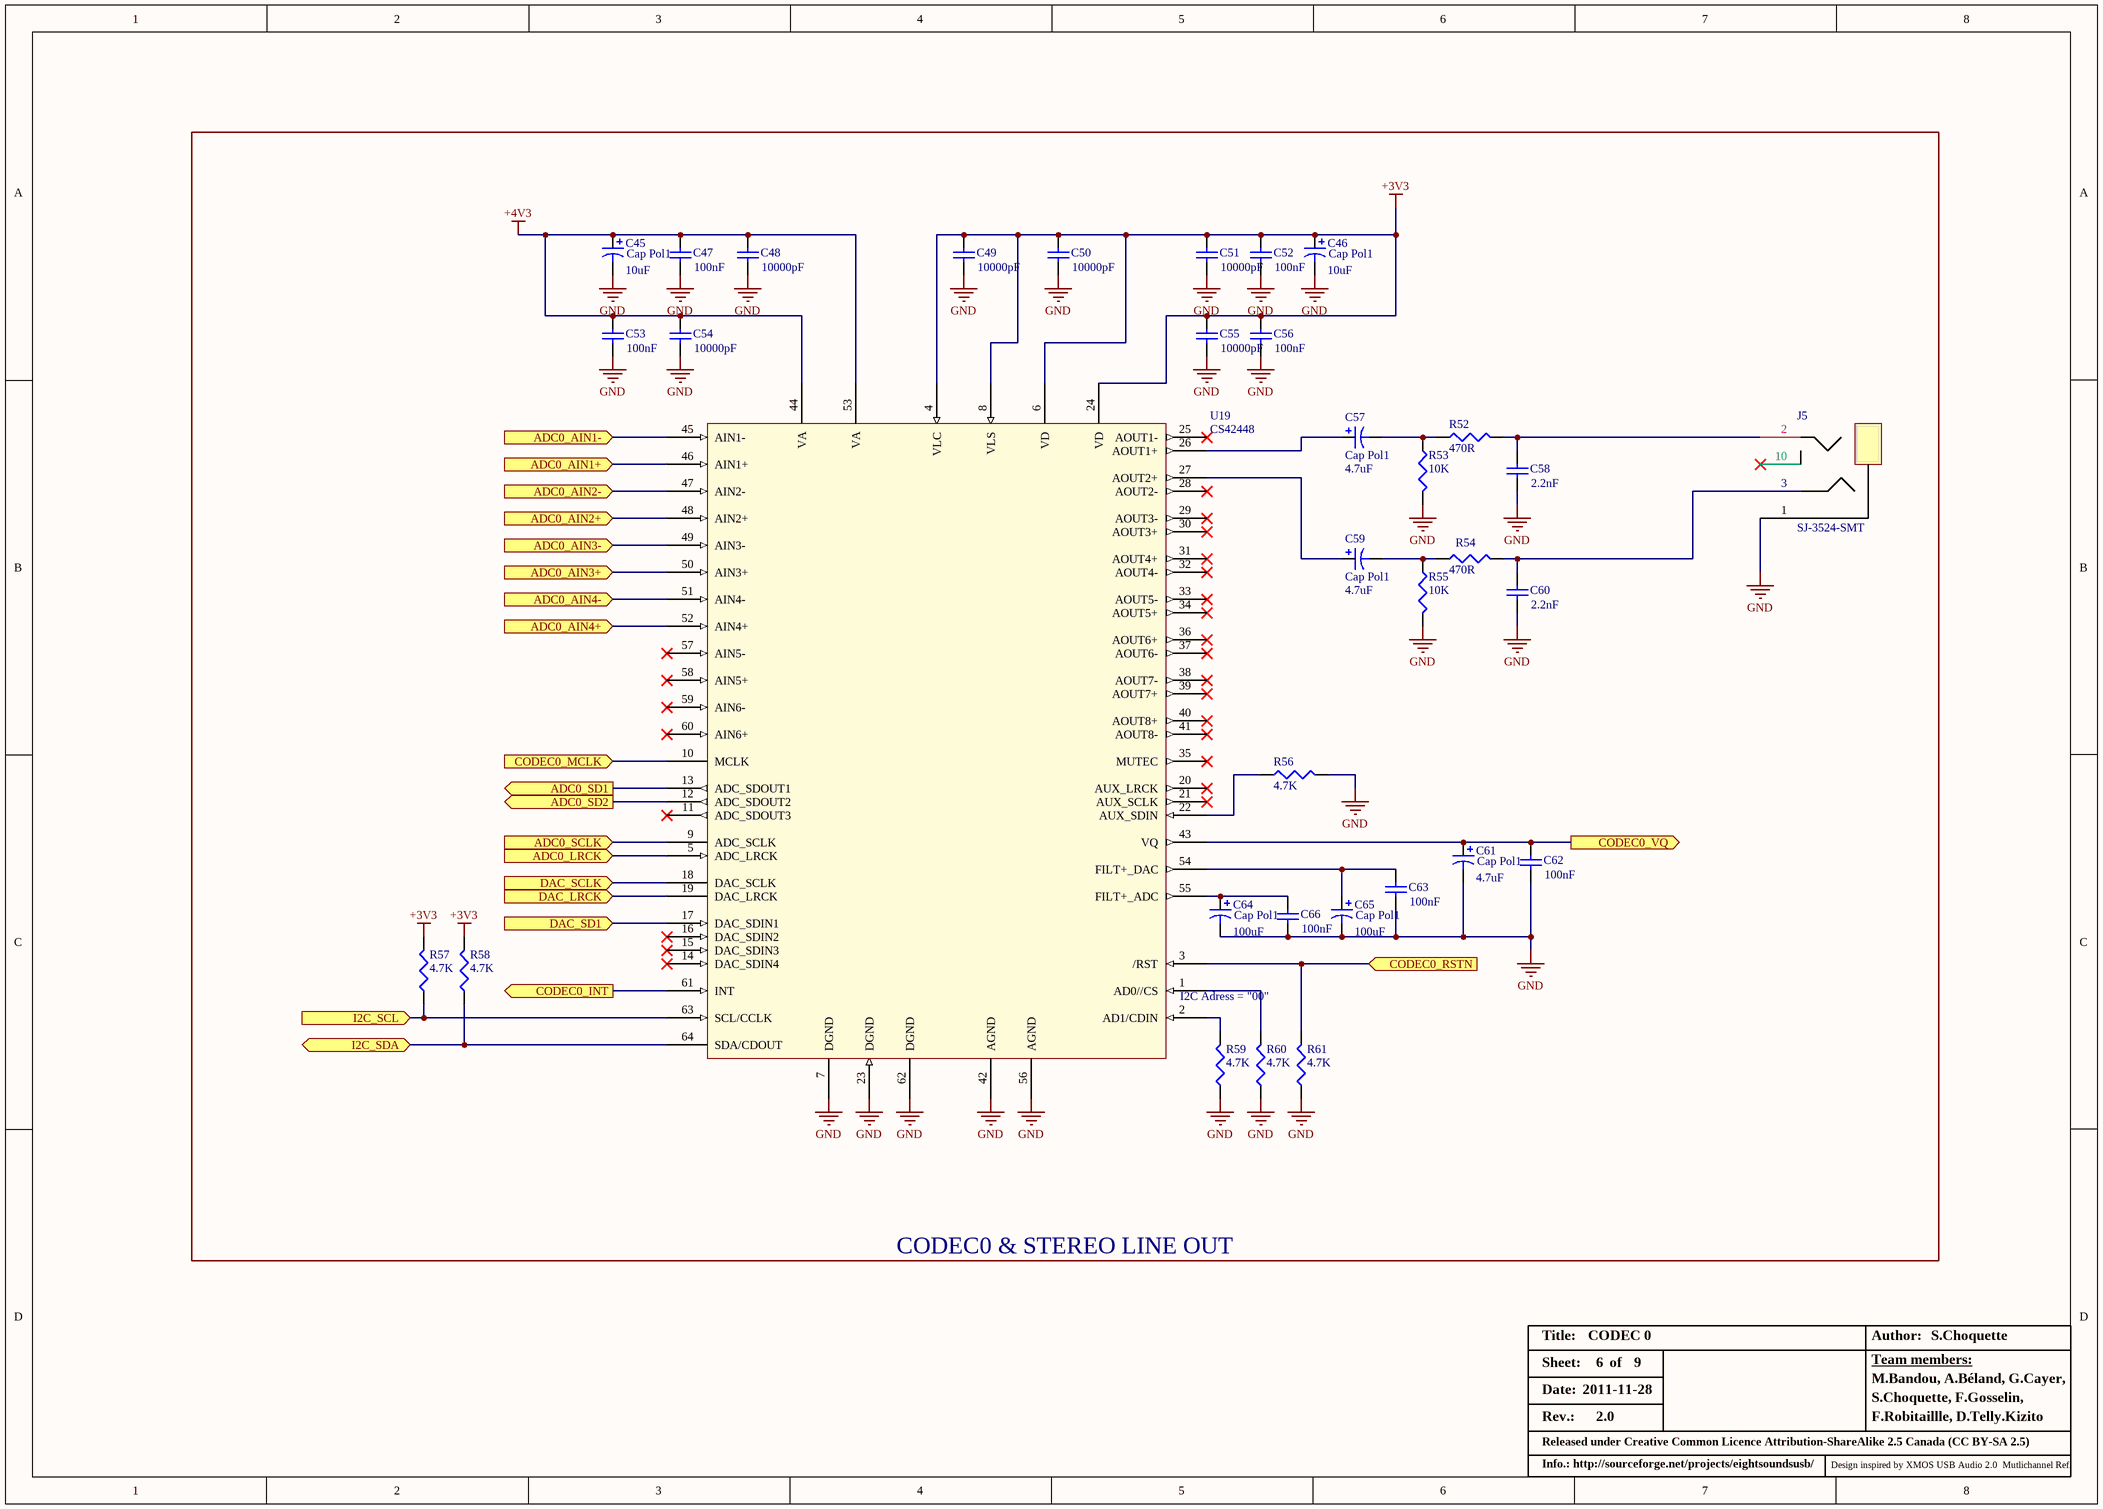
[diagram p2: CODEC0.SchDoc]

### Parts
C45  Cap Pol1  value 10uF  [AL_ELEC_SMD_B]
C46  Cap Pol1  value 10uF  [AL_ELEC_SMD_B]
C47  value 100nF  [2-0402]
C48  value 10000pF  [2-0402]
C49  value 10000pF  [2-0402]
C50  value 10000pF  [2-0402]
C51  value 10000pF  [2-0402]
C52  value 100nF  [2-0402]
C53  value 100nF  [2-0402]
C54  value 10000pF  [2-0402]
C55  value 10000pF  [2-0402]
C56  value 100nF  [2-0402]
C57  Cap Pol1  value 4.7uF  [AL_ELEC_SMD_B]
C58  value 2.2nF  [3-0603]
C59  Cap Pol1  value 4.7uF  [AL_ELEC_SMD_B]
C60  value 2.2nF  [3-0603]
C61  Cap Pol1  value 4.7uF  [AL_ELEC_SMD_B]
C62  value 100nF  [2-0402]
C63  value 100nF  [2-0402]
C64  Cap Pol1  value 100uF  [AL_ELEC_SMD_D]
C65  Cap Pol1  value 100uF  [AL_ELEC_SMD_D]
C66  value 100nF  [2-0402]
J5  SJ-3524-SMT  [SJ-3524-SMT]
R52  value 470R  [3-0603]
R53  value 10K  [3-0603]
R54  value 470R  [3-0603]
R55  value 10K  [3-0603]
R56  value 4.7K  [3-0603]
R57  value 4.7K  [3-0603]
R58  value 4.7K  [3-0603]
R59  value 4.7K  [3-0603]
R60  value 4.7K  [3-0603]
R61  value 4.7K  [3-0603]
U19  CS42448  [QFN50P1200X1200-64V1L-MOD]

### Ports
ADC0_AIN1+ (in), ADC0_AIN1- (in), ADC0_AIN2+ (in), ADC0_AIN2- (in), ADC0_AIN3+ (in), ADC0_AIN3- (in), ADC0_AIN4+ (in), ADC0_AIN4- (in), ADC0_LRCK (in), ADC0_SCLK (in), ADC0_SD1 (out), ADC0_SD2 (out), CODEC0_INT (out), CODEC0_MCLK (in), CODEC0_RSTN (in), CODEC0_VQ (out), DAC_LRCK (in), DAC_SCLK (in), DAC_SD1 (in), I2C_SCL (in), I2C_SDA (bidir)

### Nets
+3V3: C46.1 C49.2 C50.2 C51.2 C52.2 C55.2 C56.2 R57.2 R58.2 U19.4(VLC) U19.6(VD) U19.8(VLS) U19.24(VD)
+4V3: C45.1 C47.2 C48.2 C53.2 C54.2 U19.44(VA) U19.53(VA)
GND: C45.2 C46.2 C47.1 C48.1 C49.1 C50.1 C51.1 C52.1 C53.1 C54.1 C55.1 C56.1 C58.1 C60.1 C61.2 C62.1 C63.1 C64.2 C65.2 C66.1 J5.1(GND) R53.2 R55.2 R56.2 R59.1 R60.1 R61.1 U19.7(DGND) U19.23(DGND) U19.42(AGND) U19.56(AGND) U19.62(DGND)
ADC0_AIN1_N: U19.45(AIN1-) ; port ADC0_AIN1-
ADC0_AIN1_P: U19.46(AIN1+) ; port ADC0_AIN1+
ADC0_AIN2_N: U19.47(AIN2-) ; port ADC0_AIN2-
ADC0_AIN2_P: U19.48(AIN2+) ; port ADC0_AIN2+
ADC0_AIN3_N: U19.49(AIN3-) ; port ADC0_AIN3-
ADC0_AIN3_P: U19.50(AIN3+) ; port ADC0_AIN3+
ADC0_AIN4_N: U19.51(AIN4-) ; port ADC0_AIN4-
ADC0_AIN4_P: U19.52(AIN4+) ; port ADC0_AIN4+
ADC0_SD1: U19.13(ADC_SDOUT1) ; port ADC0_SD1
ADC0_SD2: U19.12(ADC_SDOUT2) ; port ADC0_SD2
CODEC0_INT: U19.61(INT) ; port CODEC0_INT
CODEC0_RSTN: R61.2 U19.3(/RST) ; port CODEC0_RSTN
CODEC0_VQ: C61.1 C62.2 U19.43(VQ) ; port CODEC0_VQ
DAC_SD1: U19.17(DAC_SDIN1) ; port DAC_SD1
I2C_SCL: R57.1 U19.63(SCL/CCLK) ; port I2C_SCL
I2C_SDA: R58.1 U19.64(SDA/CDOUT) ; port I2C_SDA
NetC57_1: C57.1 U19.26(AOUT1+)
NetC57_2: C57.2 R52.1 R53.1
NetC58_2: C58.2 J5.2(AIN2P) R52.2
NetC59_1: C59.1 U19.27(AOUT2+)
NetC59_2: C59.2 R54.1 R55.1
NetC60_2: C60.2 J5.3(AIN1P) R54.2
NetC63_2: C63.2 C65.1 U19.54(FILT+_DAC)
NetC64_1: C64.1 C66.2 U19.55(FILT+_ADC)
NetR42_1: U19.10(MCLK) ; port CODEC0_MCLK
NetR46_1: U19.9(ADC_SCLK) ; port ADC0_SCLK
NetR48_1: U19.18(DAC_SCLK) ; port DAC_SCLK
NetR49_1: U19.5(ADC_LRCK) ; port ADC0_LRCK
NetR51_1: U19.19(DAC_LRCK) ; port DAC_LRCK
NetR56_1: R56.1 U19.22(AUX_SDIN)
NetR59_2: R59.2 U19.2(AD1/CDIN)
NetR60_2: R60.2 U19.1(AD0//CS)

Not connected (* = marked no-connect by the designer): J5 10(NC)*; U19 11(ADC_SDOUT3)* 14(DAC_SDIN4)* 15(DAC_SDIN3)* 16(DAC_SDIN2)* 20(AUX_LRCK)* 21(AUX_SCLK)* 25(AOUT1-)* 28(AOUT2-)* 29(AOUT3-)* 30(AOUT3+)* 31(AOUT4+)* 32(AOUT4-)* 33(AOUT5-)* 34(AOUT5+)* 35(MUTEC)* 36(AOUT6+)* 37(AOUT6-)* 38(AOUT7-)* 39(AOUT7+)* 40(AOUT8+)* 41(AOUT8-)* 57(AIN5-)* 58(AIN5+)* 59(AIN6-)* 60(AIN6+)*

### Notes on the sheet
- (near U19) I2C Adress = "00"
- CODEC0 & STEREO LINE OUT
- Title:
- Date:
- Sheet:
- of
- Author:
- Team members:
- M.Bandou, A.Béland, G.Cayer,
- Rev.:
- Released under Creative Common Licence Attribution-ShareAlike 2.5 Canada (CC BY-SA 2.5)
- S.Choquette, F.Gosselin,
- F.Robitaillle, D.Telly.Kizito
- Info.: http://sourceforge.net/projects/eightsoundsusb/
- Design inspired by XMOS USB Audio 2.0  Mutlichannel Ref.

### Library data of the parts
C45 C46 = Cap Pol1: Al Elec 10uF CaseB 16V; Manufacturer: Panasonic; Part Number: EEEFK1C100R; Cost: *
C47 C52 C53 C56 C62 C63 C66 = Cap: as C36 on sheet CLOCKING; Cost: 0,005
C48-C51 C54 C55 = Cap: MLCC 10000pF 0402 X7R 25V; Manufacturer: Murata; Part Number: GRM155R71E103KA01D; Cost: 0,005
C57 C59 C61 = Cap Pol1: Al Elec 4.7uF CaseB 35V; Manufacturer: Panasonic; Part Number: EEEFK1V4R7R; Cost: *
C58 C60 = Cap: MLCC 2.2uF 0603 X5R 10V; Manufacturer: Murata; Part Number: GRM1885C1H222JA01; Cost: 0,005
C64 C65 = Cap Pol1: as C4 on sheet MAIN_POWER; Cost: *
J5 = SJ-3524-SMT: Stereo Jack 1/8 in, 3.5 mm; Manufacturer: CUI Inc; Part Number: SJ-3524-SMT
R52 R54 = Res3: as R45 on sheet CLOCKING; Cost: *
R53 R55 = Res3: as R3 on sheet MAIN_POWER; Cost: *
R56-R61 = Res3: RES 4.7k 0603 1%; Manufacturer: ROHM; Part Number: MCR03EZPFX4701; Cost: *
U19 = CS42448: 108 dB, 192 kHz 6-in, 8-out Multi-Channel Codec; Manufacturer: Cirrus Logic; Part Number: CS42448

## Sheet CODEC1.SchDoc: CODEC 1
size A3; Date: 2011-11-28; Author: S.Choquette; Revision: 2.0; SheetNumber: 7; SheetTotal: 9
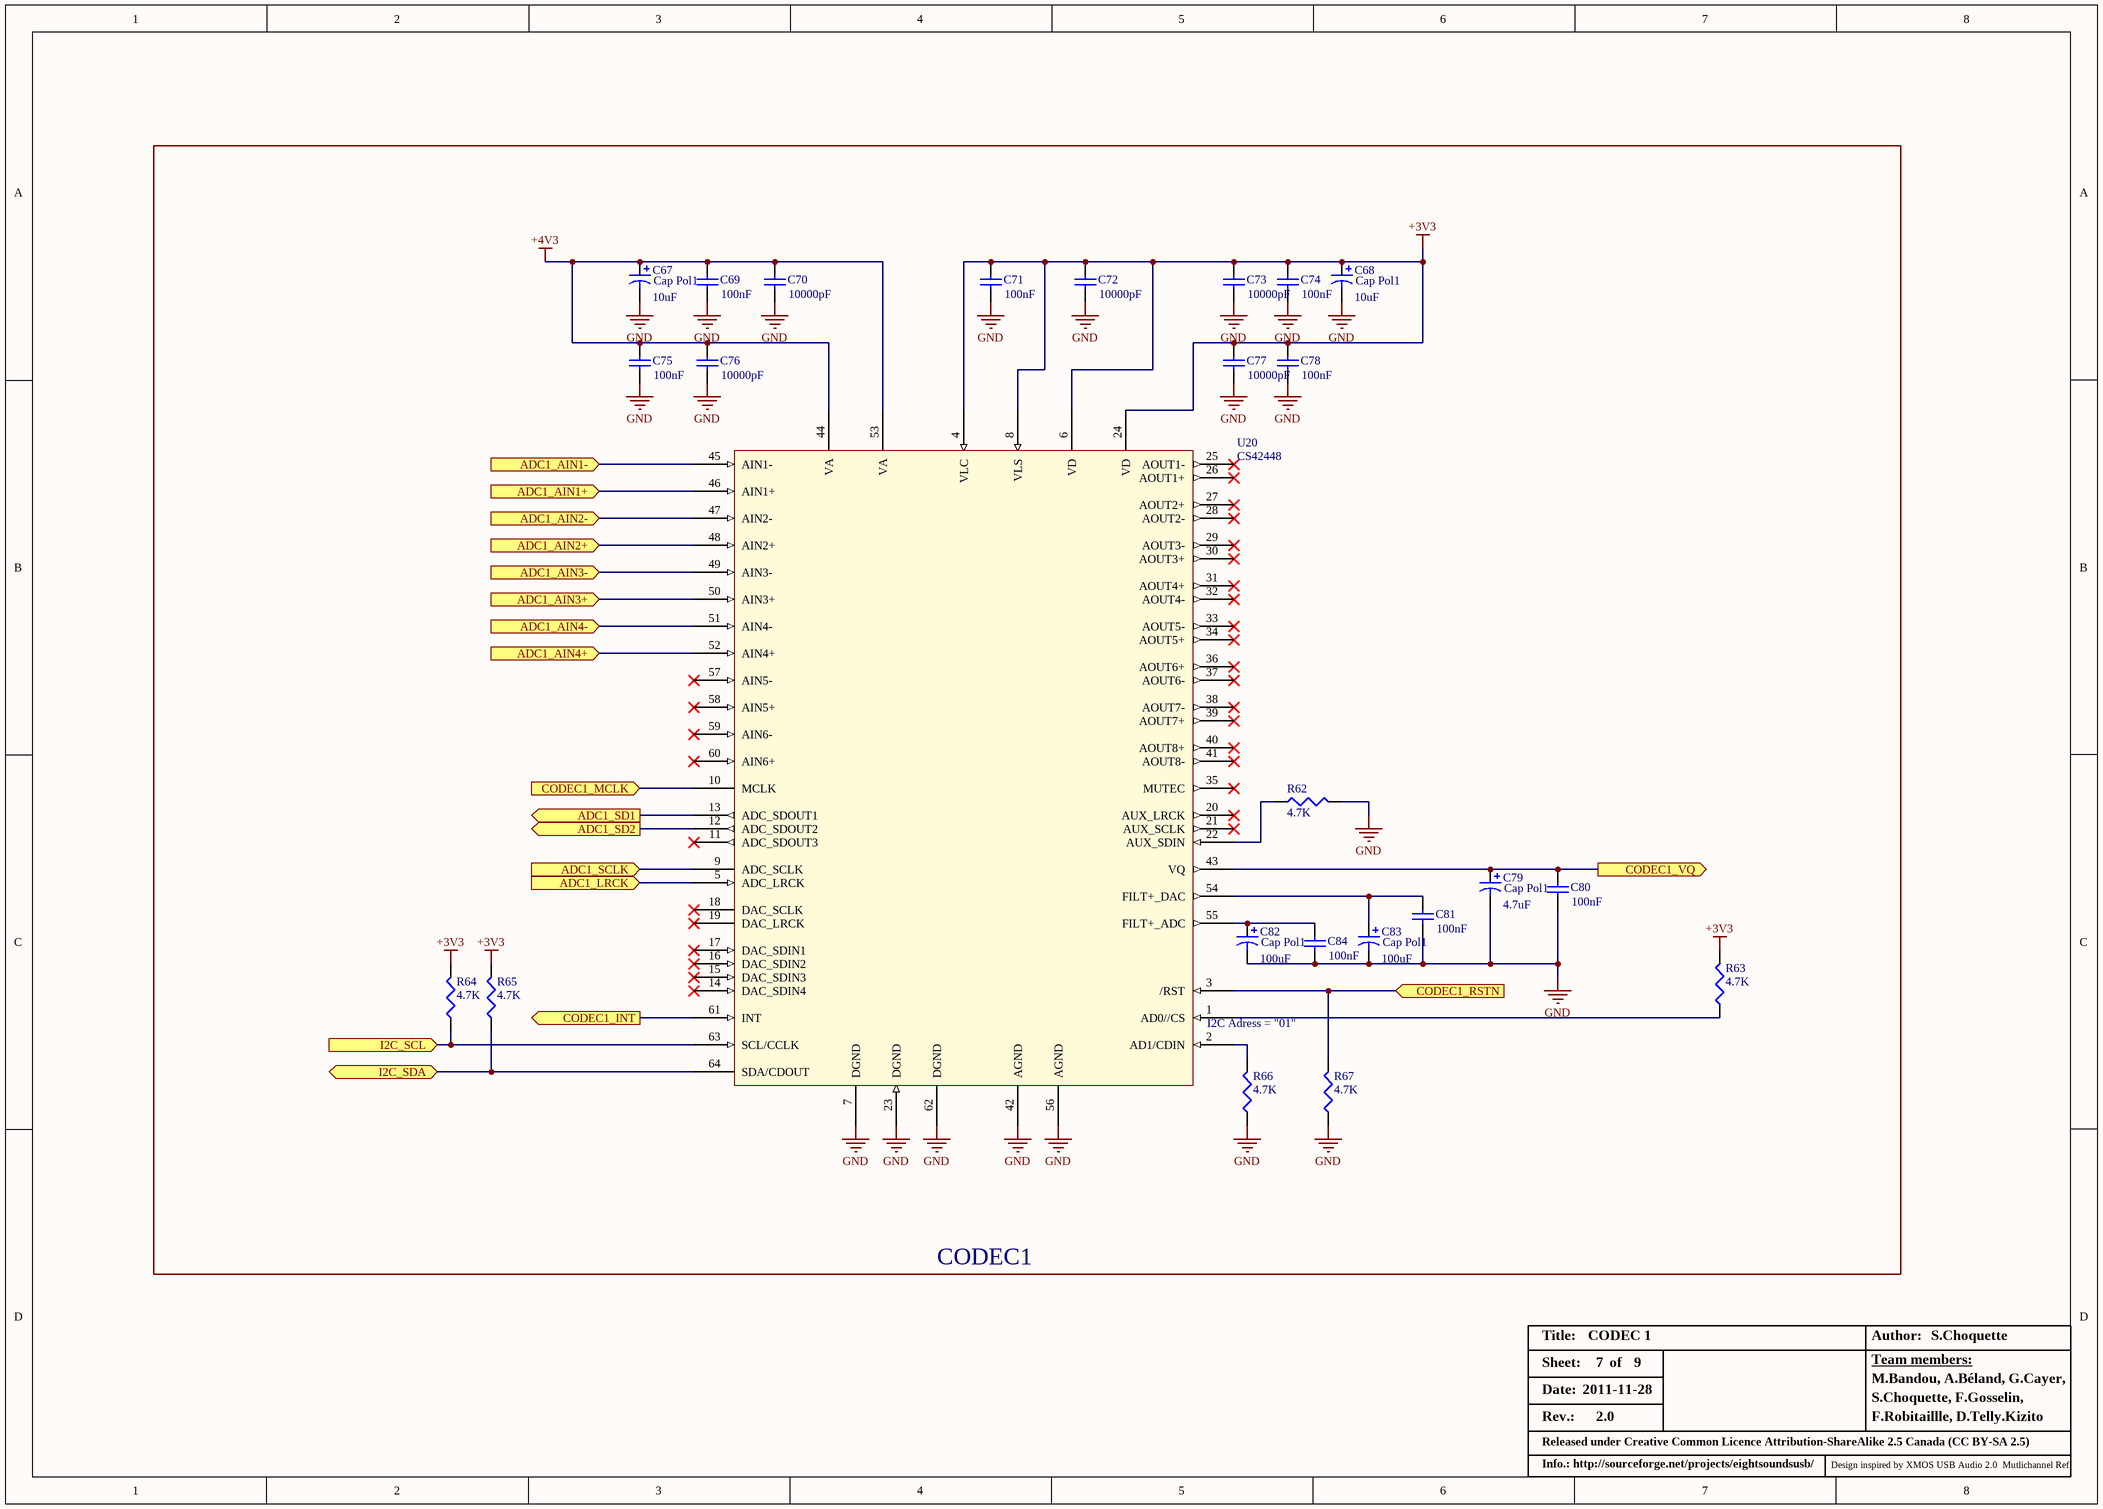
[diagram p3: CODEC1.SchDoc]

### Parts
C67  Cap Pol1  value 10uF  [AL_ELEC_SMD_B]
C68  Cap Pol1  value 10uF  [AL_ELEC_SMD_B]
C69  value 100nF  [2-0402]
C70  value 10000pF  [2-0402]
C71  value 100nF  [2-0402]
C72  value 10000pF  [2-0402]
C73  value 10000pF  [2-0402]
C74  value 100nF  [2-0402]
C75  value 100nF  [2-0402]
C76  value 10000pF  [2-0402]
C77  value 10000pF  [2-0402]
C78  value 100nF  [2-0402]
C79  Cap Pol1  value 4.7uF  [AL_ELEC_SMD_B]
C80  value 100nF  [2-0402]
C81  value 100nF  [2-0402]
C82  Cap Pol1  value 100uF  [AL_ELEC_SMD_D]
C83  Cap Pol1  value 100uF  [AL_ELEC_SMD_D]
C84  value 100nF  [2-0402]
R62  value 4.7K  [3-0603]
R63  value 4.7K  [3-0603]
R64  value 4.7K  [3-0603]
R65  value 4.7K  [3-0603]
R66  value 4.7K  [3-0603]
R67  value 4.7K  [3-0603]
U20  CS42448  [QFN50P1200X1200-64V1L-MOD]

### Ports
ADC1_AIN1+ (in), ADC1_AIN1- (in), ADC1_AIN2+ (in), ADC1_AIN2- (in), ADC1_AIN3+ (in), ADC1_AIN3- (in), ADC1_AIN4+ (in), ADC1_AIN4- (in), ADC1_LRCK (in), ADC1_SCLK (in), ADC1_SD1 (out), ADC1_SD2 (out), CODEC1_INT (out), CODEC1_MCLK (in), CODEC1_RSTN (in), CODEC1_VQ (out), I2C_SCL (in), I2C_SDA (bidir)

### Nets
+3V3: C68.1 C71.2 C72.2 C73.2 C74.2 C77.2 C78.2 R63.2 R64.2 R65.2 U20.4(VLC) U20.6(VD) U20.8(VLS) U20.24(VD)
+4V3: C67.1 C69.2 C70.2 C75.2 C76.2 U20.44(VA) U20.53(VA)
GND: C67.2 C68.2 C69.1 C70.1 C71.1 C72.1 C73.1 C74.1 C75.1 C76.1 C77.1 C78.1 C79.2 C80.1 C81.1 C82.2 C83.2 C84.1 R62.2 R66.1 R67.1 U20.7(DGND) U20.23(DGND) U20.42(AGND) U20.56(AGND) U20.62(DGND)
ADC1_AIN1_N: U20.45(AIN1-) ; port ADC1_AIN1-
ADC1_AIN1_P: U20.46(AIN1+) ; port ADC1_AIN1+
ADC1_AIN2_N: U20.47(AIN2-) ; port ADC1_AIN2-
ADC1_AIN2_P: U20.48(AIN2+) ; port ADC1_AIN2+
ADC1_AIN3_N: U20.49(AIN3-) ; port ADC1_AIN3-
ADC1_AIN3_P: U20.50(AIN3+) ; port ADC1_AIN3+
ADC1_AIN4_N: U20.51(AIN4-) ; port ADC1_AIN4-
ADC1_AIN4_P: U20.52(AIN4+) ; port ADC1_AIN4+
ADC1_SD1: U20.13(ADC_SDOUT1) ; port ADC1_SD1
ADC1_SD2: U20.12(ADC_SDOUT2) ; port ADC1_SD2
CODEC1_INT: U20.61(INT) ; port CODEC1_INT
CODEC1_RSTN: R67.2 U20.3(/RST) ; port CODEC1_RSTN
CODEC1_VQ: C79.1 C80.2 U20.43(VQ) ; port CODEC1_VQ
I2C_SCL: R64.1 U20.63(SCL/CCLK) ; port I2C_SCL
I2C_SDA: R65.1 U20.64(SDA/CDOUT) ; port I2C_SDA
NetC81_2: C81.2 C83.1 U20.54(FILT+_DAC)
NetC82_1: C82.1 C84.2 U20.55(FILT+_ADC)
NetR43_1: U20.10(MCLK) ; port CODEC1_MCLK
NetR47_1: U20.9(ADC_SCLK) ; port ADC1_SCLK
NetR50_1: U20.5(ADC_LRCK) ; port ADC1_LRCK
NetR62_1: R62.1 U20.22(AUX_SDIN)
NetR63_1: R63.1 U20.1(AD0//CS)
NetR66_2: R66.2 U20.2(AD1/CDIN)

Not connected (* = marked no-connect by the designer): U20 11(ADC_SDOUT3)* 14(DAC_SDIN4)* 15(DAC_SDIN3)* 16(DAC_SDIN2)* 17(DAC_SDIN1)* 18(DAC_SCLK)* 19(DAC_LRCK)* 20(AUX_LRCK)* 21(AUX_SCLK)* 25(AOUT1-)* 26(AOUT1+)* 27(AOUT2+)* 28(AOUT2-)* 29(AOUT3-)* 30(AOUT3+)* 31(AOUT4+)* 32(AOUT4-)* 33(AOUT5-)* 34(AOUT5+)* 35(MUTEC)* 36(AOUT6+)* 37(AOUT6-)* 38(AOUT7-)* 39(AOUT7+)* 40(AOUT8+)* 41(AOUT8-)* 57(AIN5-)* 58(AIN5+)* 59(AIN6-)* 60(AIN6+)*

### Notes on the sheet
- (near U20) I2C Adress = "01"
- CODEC1
- Title:
- Date:
- Sheet:
- of
- Author:
- Team members:
- M.Bandou, A.Béland, G.Cayer,
- Rev.:
- Released under Creative Common Licence Attribution-ShareAlike 2.5 Canada (CC BY-SA 2.5)
- S.Choquette, F.Gosselin,
- F.Robitaillle, D.Telly.Kizito
- Info.: http://sourceforge.net/projects/eightsoundsusb/
- Design inspired by XMOS USB Audio 2.0  Mutlichannel Ref.

### Library data of the parts
C67 C68 = Cap Pol1: as C45 on sheet CODEC0; Cost: *
C69 C71 C74 C75 C78 C80 C81 C84 = Cap: as C36 on sheet CLOCKING; Cost: 0,005
C70 C72 C73 C76 C77 = Cap: as C48 on sheet CODEC0; Cost: 0,005
C79 = Cap Pol1: as C57 on sheet CODEC0; Cost: *
C82 C83 = Cap Pol1: as C4 on sheet MAIN_POWER; Cost: *
R62-R67 = Res3: as R56 on sheet CODEC0; Cost: *
U20 = CS42448: as U19 on sheet CODEC0; Part Number: CS42448

## Sheet PREAMP0.SchDoc: PREAMP 0
size A3; Date: 2011-11-28; Author: S.Choquette; Revision: 2.0; SheetNumber: 8; SheetTotal: 9
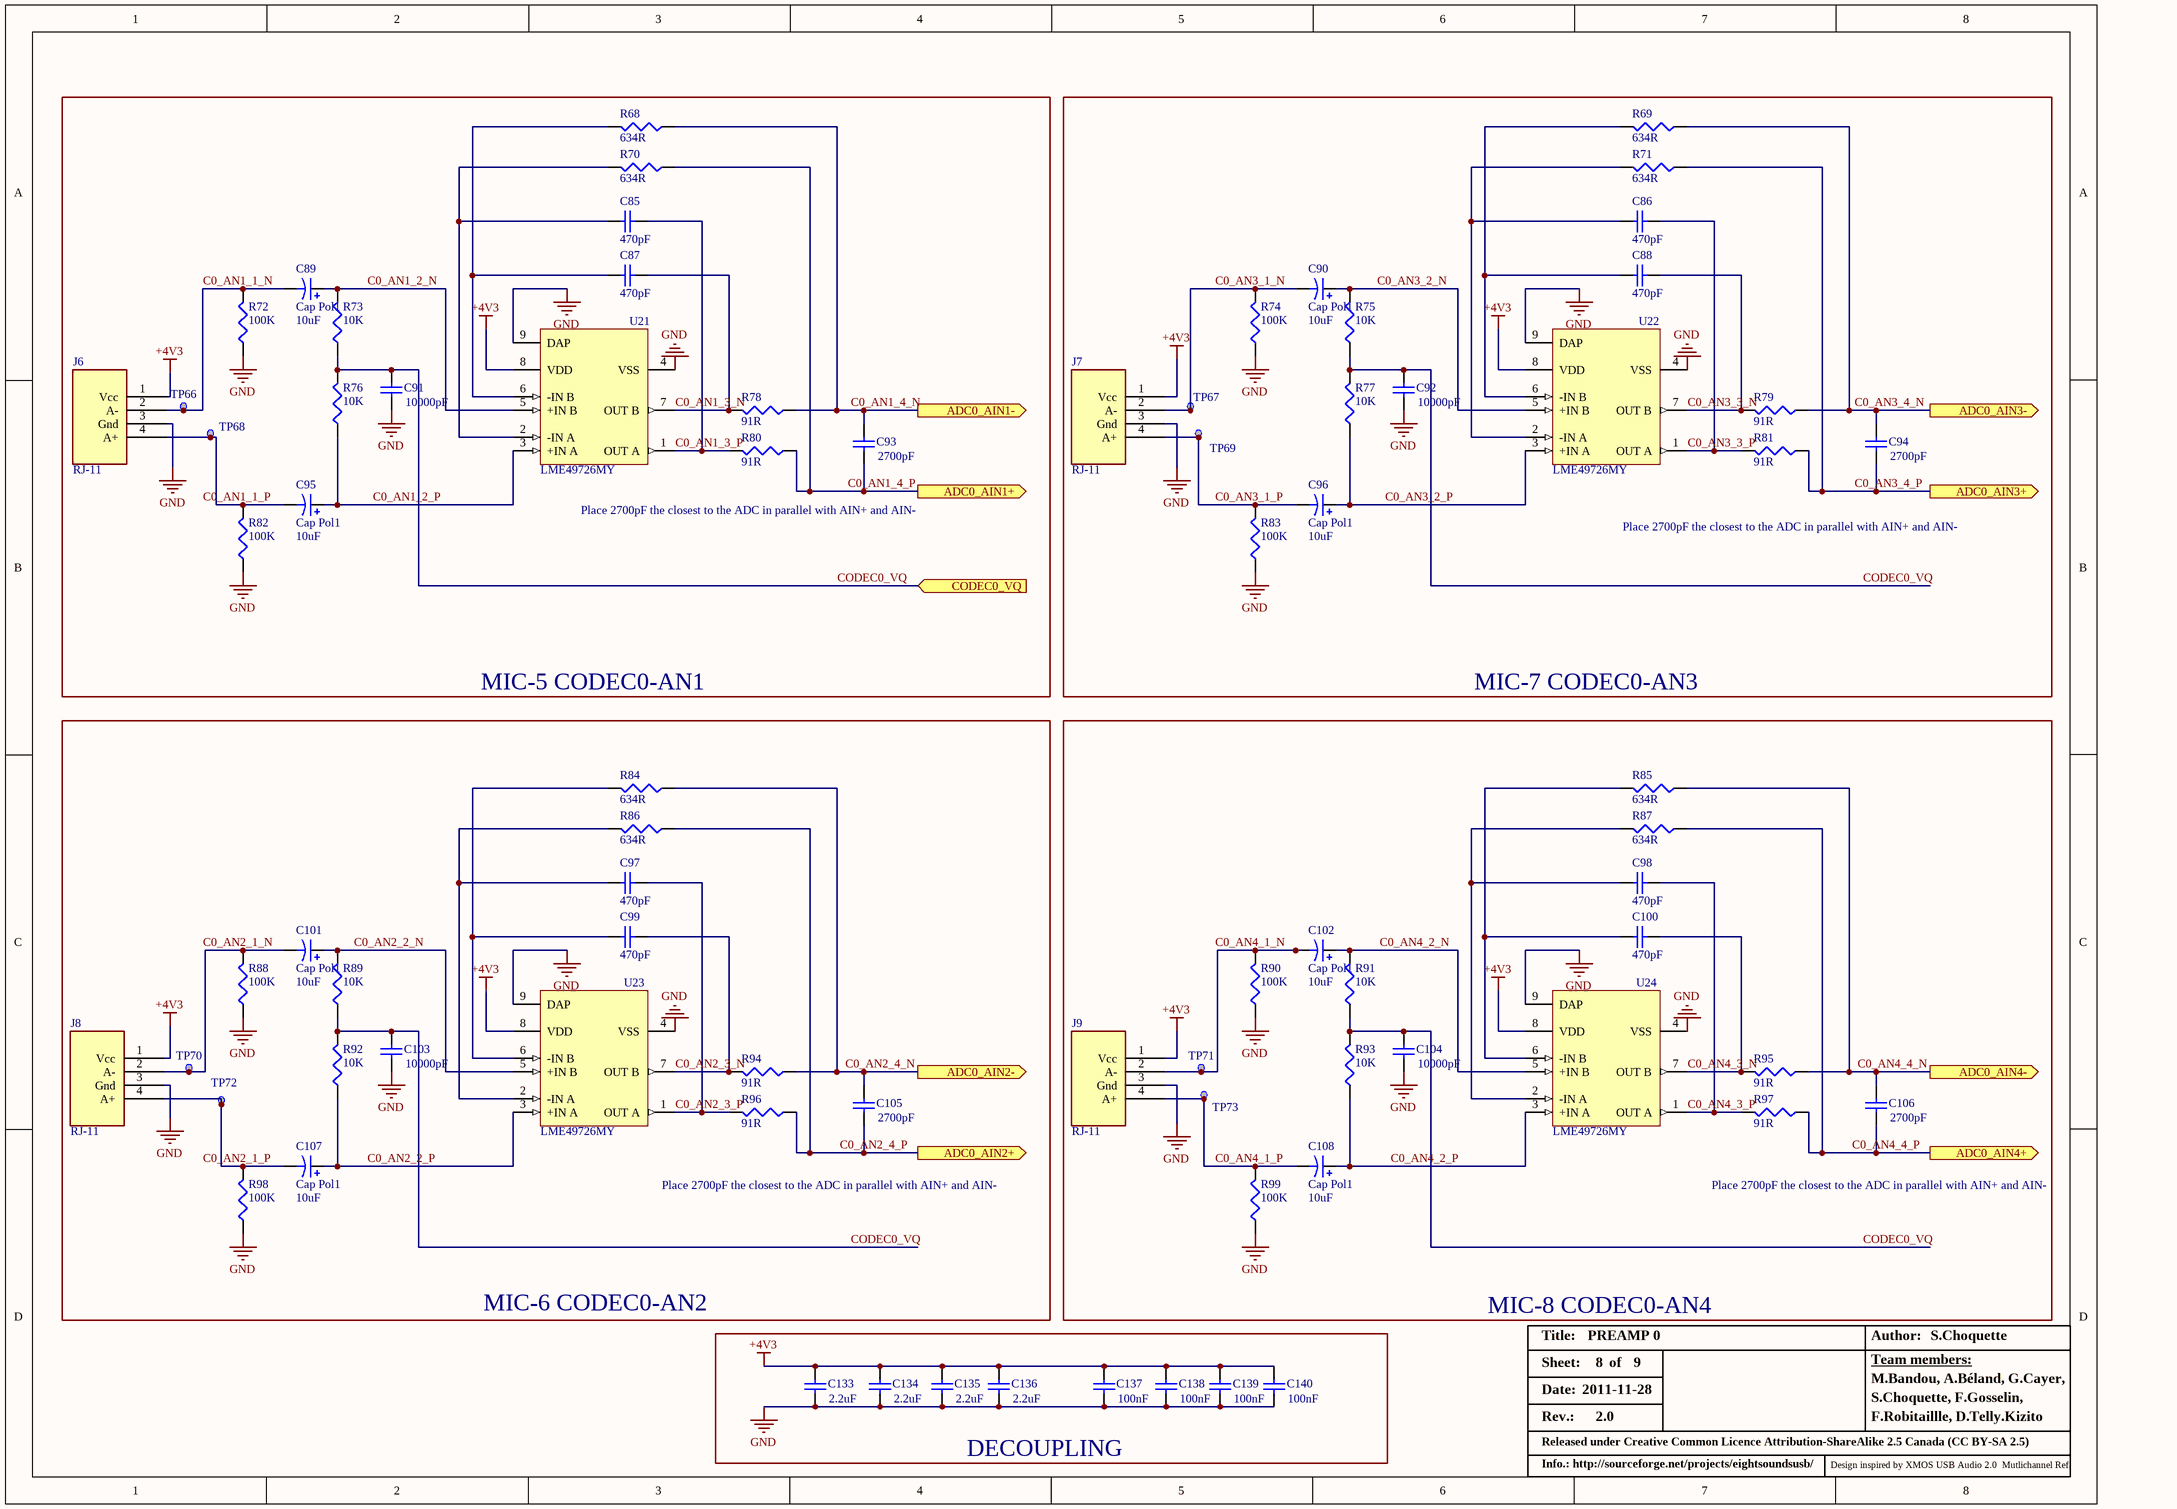
[diagram p4: PREAMP0.SchDoc]

### Parts
C85  value 470pF  [3-0603]
C86  value 470pF  [3-0603]
C87  value 470pF  [3-0603]
C88  value 470pF  [3-0603]
C89  Cap Pol1  value 10uF  [AL_ELEC_SMD_B]
C90  Cap Pol1  value 10uF  [AL_ELEC_SMD_B]
C91  value 10000pF  [2-0402]
C92  value 10000pF  [2-0402]
C93  value 2700pF  [2-0402]
C94  value 2700pF  [2-0402]
C95  Cap Pol1  value 10uF  [AL_ELEC_SMD_B]
C96  Cap Pol1  value 10uF  [AL_ELEC_SMD_B]
C97  value 470pF  [3-0603]
C98  value 470pF  [3-0603]
C99  value 470pF  [3-0603]
C100  value 470pF  [3-0603]
C101  Cap Pol1  value 10uF  [AL_ELEC_SMD_B]
C102  Cap Pol1  value 10uF  [AL_ELEC_SMD_B]
C103  value 10000pF  [2-0402]
C104  value 10000pF  [2-0402]
C105  value 2700pF  [2-0402]
C106  value 2700pF  [2-0402]
C107  Cap Pol1  value 10uF  [AL_ELEC_SMD_B]
C108  Cap Pol1  value 10uF  [AL_ELEC_SMD_B]
C133  value 2.2uF  [8-1206]
C134  value 2.2uF  [8-1206]
C135  value 2.2uF  [8-1206]
C136  value 2.2uF  [8-1206]
C137  value 100nF  [2-0402]
C138  value 100nF  [2-0402]
C139  value 100nF  [2-0402]
C140  value 100nF  [2-0402]
J6  RJ-11  [RJ11]
J7  RJ-11  [RJ11]
J8  RJ-11  [RJ11]
J9  RJ-11  [RJ11]
R68  value 634R  [3-0603]
R69  value 634R  [3-0603]
R70  value 634R  [3-0603]
R71  value 634R  [3-0603]
R72  value 100K  [3-0603]
R73  value 10K  [3-0603]
R74  value 100K  [3-0603]
R75  value 10K  [3-0603]
R76  value 10K  [3-0603]
R77  value 10K  [3-0603]
R78  value 91R  [3-0603]
R79  value 91R  [3-0603]
R80  value 91R  [3-0603]
R81  value 91R  [3-0603]
R82  value 100K  [3-0603]
R83  value 100K  [3-0603]
R84  value 634R  [3-0603]
R85  value 634R  [3-0603]
R86  value 634R  [3-0603]
R87  value 634R  [3-0603]
R88  value 100K  [3-0603]
R89  value 10K  [3-0603]
R90  value 100K  [3-0603]
R91  value 10K  [3-0603]
R92  value 10K  [3-0603]
R93  value 10K  [3-0603]
R94  value 91R  [3-0603]
R95  value 91R  [3-0603]
R96  value 91R  [3-0603]
R97  value 91R  [3-0603]
R98  value 100K  [3-0603]
R99  value 100K  [3-0603]
TP66  TP  [TP]  (value not drawn)
TP67  TP  [TP]  (value not drawn)
TP68  TP  [TP]  (value not drawn)
TP69  TP  [TP]  (value not drawn)
TP70  TP  [TP]  (value not drawn)
TP71  TP  [TP]  (value not drawn)
TP72  TP  [TP]  (value not drawn)
TP73  TP  [TP]  (value not drawn)
U21  LME49726MY  [LME49726]
U22  LME49726MY  [LME49726]
U23  LME49726MY  [LME49726]
U24  LME49726MY  [LME49726]

### Blocks framed on the sheet
MIC-5 CODEC0-AN1: C85 C87 C89 C91 C93 C95 J6 R68 R70 R72 R73 R76 R78 R80 R82 TP66 TP68 U21
MIC-7 CODEC0-AN3: C86 C88 C90 C92 C94 C96 J7 R69 R71 R74 R75 R77 R79 R81 R83 TP67 TP69 U22
MIC-6 CODEC0-AN2: C97 C99 C101 C103 C105 C107 J8 R84 R86 R88 R89 R92 R94 R96 R98 TP70 TP72 U23
MIC-8 CODEC0-AN4: C98 C100 C102 C104 C106 C108 J9 R85 R87 R90 R91 R93 R95 R97 R99 TP71 TP73 U24
DECOUPLING: C133-C140

### Ports
ADC0_AIN1+ (out), ADC0_AIN1- (out), ADC0_AIN2+ (out), ADC0_AIN2- (out), ADC0_AIN3+ (out), ADC0_AIN3- (out), ADC0_AIN4+ (out), ADC0_AIN4- (out), CODEC0_VQ (in)

### Nets
+4V3: C133.2 C134.2 C135.2 C136.2 C137.2 C138.2 C139.2 C140.2 J6.1(Vcc) J7.1(Vcc) J8.1(Vcc) J9.1(Vcc) U21.8(VDD) U22.8(VDD) U23.8(VDD) U24.8(VDD)
GND: C91.1 C92.1 C103.1 C104.1 C133.1 C134.1 C135.1 C136.1 C137.1 C138.1 C139.1 C140.1 J6.3(Gnd) J7.3(Gnd) J8.3(Gnd) J9.3(Gnd) R72.1 R74.1 R82.1 R83.1 R88.1 R90.1 R98.1 R99.1 U21.4(VSS) U21.9(DAP) U22.4(VSS) U22.9(DAP) U23.4(VSS) U23.9(DAP) U24.4(VSS) U24.9(DAP)
C0_AN1_1_N: C89.2 J6.2(A-) R72.2 TP66.1
C0_AN1_2_N: C89.1 R73.2 U21.5(+IN_B)
C0_AN1_2_P: C95.1 R76.1 U21.3(+IN_A)
C0_AN1_3_N: C87.1 R78.2 U21.7(OUT_B)
C0_AN1_3_P: C85.1 R80.2 U21.1(OUT_A)
C0_AN1_4_N: C93.2 R68.1 R78.1 ; port ADC0_AIN1-  [project net ADC0_AIN1_N]
C0_AN1_4_P: C93.1 R70.1 R80.1 ; port ADC0_AIN1+  [project net ADC0_AIN1_P]
C0_AN2_2_N: C101.1 R89.2 U23.5(+IN_B)
C0_AN2_2_P: C107.1 R92.1 U23.3(+IN_A)
C0_AN2_3_N: C99.1 R94.2 U23.7(OUT_B)
C0_AN2_3_P: C97.1 R96.2 U23.1(OUT_A)
C0_AN2_4_N: C105.2 R84.1 R94.1 ; port ADC0_AIN2-  [project net ADC0_AIN2_N]
C0_AN2_4_P: C105.1 R86.1 R96.1 ; port ADC0_AIN2+  [project net ADC0_AIN2_P]
C0_AN3_1_N: C90.2 J7.2(A-) R74.2 TP67.1
C0_AN3_1_P: C96.2 J7.4(A+) R83.2 TP69.1
C0_AN3_2_N: C90.1 R75.2 U22.5(+IN_B)
C0_AN3_2_P: C96.1 R77.1 U22.3(+IN_A)
C0_AN3_3_N: C88.1 R79.2 U22.7(OUT_B)
C0_AN3_3_P: C86.1 R81.2 U22.1(OUT_A)
C0_AN3_4_N: C94.2 R69.1 R79.1 ; port ADC0_AIN3-  [project net ADC0_AIN3_N]
C0_AN3_4_P: C94.1 R71.1 R81.1 ; port ADC0_AIN3+  [project net ADC0_AIN3_P]
C0_AN4_1_P: C108.2 J9.4(A+) R99.2 TP73.1
C0_AN4_2_N: C102.1 R91.2 U24.5(+IN_B)
C0_AN4_2_P: C108.1 R93.1 U24.3(+IN_A)
C0_AN4_3_N: C100.1 R95.2 U24.7(OUT_B)
C0_AN4_3_P: C98.1 R97.2 U24.1(OUT_A)
C0_AN4_4_N: C106.2 R85.1 R95.1 ; port ADC0_AIN4-  [project net ADC0_AIN4_N]
C0_AN4_4_P: C106.1 R87.1 R97.1 ; port ADC0_AIN4+  [project net ADC0_AIN4_P]
CODEC0_VQ: C91.2 C92.2 C103.2 C104.2 R73.1 R75.1 R76.2 R77.2 R89.1 R91.1 R92.2 R93.2 ; port CODEC0_VQ
NetC85_2: C85.2 R70.2 U21.2(-IN_A)
NetC86_2: C86.2 R71.2 U22.2(-IN_A)
NetC87_2: C87.2 R68.2 U21.6(-IN_B)
NetC88_2: C88.2 R69.2 U22.6(-IN_B)
NetC95_2: C95.2 J6.4(A+) R82.2 TP68.1
NetC97_2: C97.2 R86.2 U23.2(-IN_A)
NetC98_2: C98.2 R87.2 U24.2(-IN_A)
NetC99_2: C99.2 R84.2 U23.6(-IN_B)
NetC100_2: C100.2 R85.2 U24.6(-IN_B)
NetC101_2: C101.2 J8.2(A-) R88.2 TP70.1
NetC102_2: C102.2 J9.2(A-) R90.2 TP71.1
NetC107_2: C107.2 J8.4(A+) R98.2 TP72.1

### Notes on the sheet
- Place 2700pF the closest to the ADC in parallel with AIN+ and AIN-
- Labels drawn without touching a wire or pin: C0_AN1_1_P, C0_AN2_1_N, C0_AN2_1_P, C0_AN4_1_N
- Title:
- Date:
- Sheet:
- of
- Author:
- Team members:
- M.Bandou, A.Béland, G.Cayer,
- Rev.:
- Released under Creative Common Licence Attribution-ShareAlike 2.5 Canada (CC BY-SA 2.5)
- S.Choquette, F.Gosselin,
- F.Robitaillle, D.Telly.Kizito
- Info.: http://sourceforge.net/projects/eightsoundsusb/
- Design inspired by XMOS USB Audio 2.0  Mutlichannel Ref.

### Library data of the parts
C85-C88 C97-C100 = Cap: MLCC 470pF 0603 COG 50V; Manufacturer: Murata; Part Number: GRM1885C1H471JA01D; Cost: 0,005
C89 C90 C95 C96 C101 C102 C107 C108 = Cap Pol1: as C45 on sheet CODEC0; Cost: *
C91 C92 C103 C104 = Cap: as C48 on sheet CODEC0; Cost: 0,005
C93 C94 C105 C106 = Cap: Temperature Compensating 2700pF 0402 COG 10V; Manufacturer: Murata; Part Number: GRM1557U1A272JA01D; Cost: 0,005
C133-C136 = Cap: as C7 on sheet MAIN_POWER
C137-C140 = Cap: as C36 on sheet CLOCKING; Cost: 0,005
J6 J8 J9 = RJ-11: CONN 6-4 MOD JACK; Part Number: SS-6446-NF; Manufacturer: Stewart Connector
J7 = RJ-11: CONN 6-4 MOD JACK; Manufacturer: Stewart Connector; Part Number: SS-6446-NF
R68-R71 R84-R87 = Res3: as R7 on sheet MAIN_POWER; Cost: *
R72 R74 R82 R83 R88 R90 R98 R99 = Res3: RES 100k 0603 1%; Manufacturer: ROHM; Part Number: MCR03EZPFX1003; Cost: *
R73 R75-R77 R89 R91-R93 = Res3: as R3 on sheet MAIN_POWER; Cost: *
R78-R81 R94-R97 = Res3: RES 634R 0603 1%; Manufacturer: ROHM; Part Number: MCR03EZPFX91R0; Cost: *
U21-U24 = LME49726MY: High Current, Low Distortion Rail-to-Rail Output Audio Operational Amplifier; Manufacturer: National Semiconductor; CompType: Audio IC; PackageTopMarking: ZXTT*ZA3; PowerWise: N; Published: 4-Dec-2008; DatasheetVersion: Nov-2008; PackageVersion: revA, Nov-2003; PackageReference: MUY08A; Publisher: Altium Limited; PackageDescription: Molded Mini-SO, Exposed Pad, .118 x .118 x .034in Body, 8 Lead, .0256in Pitch; Part Number: LME49726MY; RoHS: Y; PinCount: 8; Code_JEDEC: MO-187-AA; ComponentLink1Description: LME49726 Datasheet; ComponentLink1URL: http://www.national.com/ds/LM/LME49726.pdf; ComponentLink2Description: LME49726 Web Page; ComponentLink2URL: http://www.national.com/pf/LM/LME49726.html; ComponentLink3Description: MUY08A Package Page; ComponentLink3URL: http://www.national.com/packaging/folders/muy08a.html

## Sheet PREAMP1.SchDoc: PREAMP 1
size A3; Date: 2011-11-28; Author: S.Choquette; Revision: 2.0; SheetNumber: 9; SheetTotal: 9
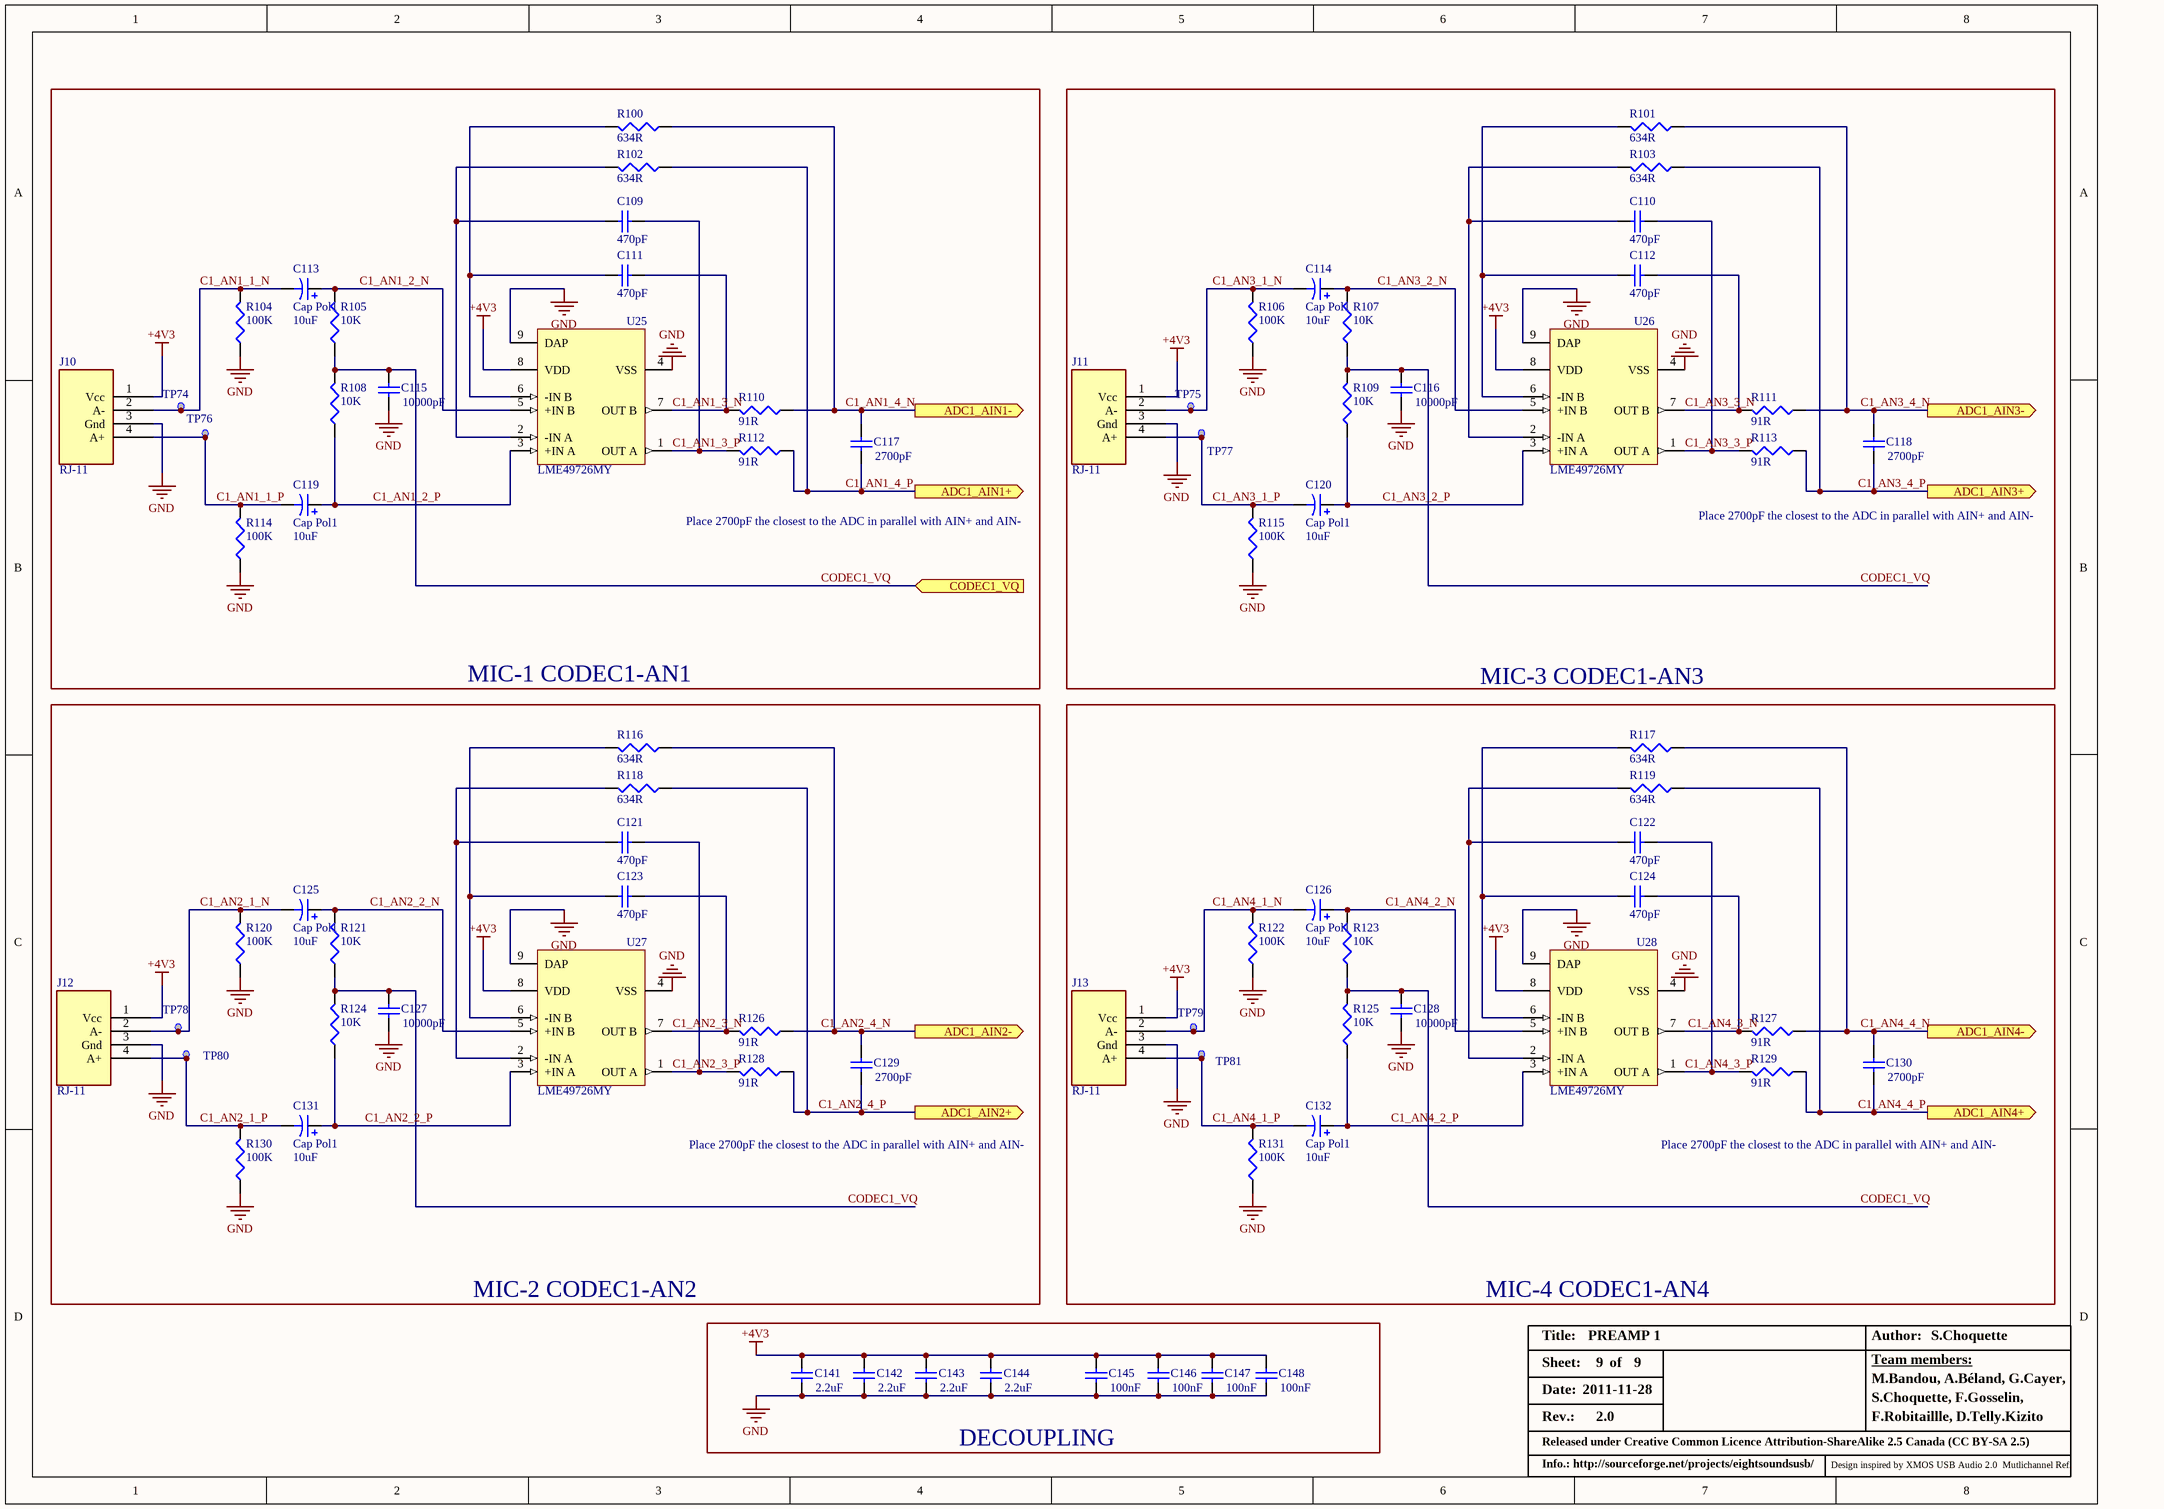
[diagram p5: PREAMP1.SchDoc]

### Parts
C109  value 470pF  [3-0603]
C110  value 470pF  [3-0603]
C111  value 470pF  [3-0603]
C112  value 470pF  [3-0603]
C113  Cap Pol1  value 10uF  [AL_ELEC_SMD_B]
C114  Cap Pol1  value 10uF  [AL_ELEC_SMD_B]
C115  value 10000pF  [2-0402]
C116  value 10000pF  [2-0402]
C117  value 2700pF  [2-0402]
C118  value 2700pF  [2-0402]
C119  Cap Pol1  value 10uF  [AL_ELEC_SMD_B]
C120  Cap Pol1  value 10uF  [AL_ELEC_SMD_B]
C121  value 470pF  [3-0603]
C122  value 470pF  [3-0603]
C123  value 470pF  [3-0603]
C124  value 470pF  [3-0603]
C125  Cap Pol1  value 10uF  [AL_ELEC_SMD_B]
C126  Cap Pol1  value 10uF  [AL_ELEC_SMD_B]
C127  value 10000pF  [2-0402]
C128  value 10000pF  [2-0402]
C129  value 2700pF  [2-0402]
C130  value 2700pF  [2-0402]
C131  Cap Pol1  value 10uF  [AL_ELEC_SMD_B]
C132  Cap Pol1  value 10uF  [AL_ELEC_SMD_B]
C141  value 2.2uF  [8-1206]
C142  value 2.2uF  [8-1206]
C143  value 2.2uF  [8-1206]
C144  value 2.2uF  [8-1206]
C145  value 100nF  [2-0402]
C146  value 100nF  [2-0402]
C147  value 100nF  [2-0402]
C148  value 100nF  [2-0402]
J10  RJ-11  [RJ11]
J11  RJ-11  [RJ11]
J12  RJ-11  [RJ11]
J13  RJ-11  [RJ11]
R100  value 634R  [3-0603]
R101  value 634R  [3-0603]
R102  value 634R  [3-0603]
R103  value 634R  [3-0603]
R104  value 100K  [3-0603]
R105  value 10K  [3-0603]
R106  value 100K  [3-0603]
R107  value 10K  [3-0603]
R108  value 10K  [3-0603]
R109  value 10K  [3-0603]
R110  value 91R  [3-0603]
R111  value 91R  [3-0603]
R112  value 91R  [3-0603]
R113  value 91R  [3-0603]
R114  value 100K  [3-0603]
R115  value 100K  [3-0603]
R116  value 634R  [3-0603]
R117  value 634R  [3-0603]
R118  value 634R  [3-0603]
R119  value 634R  [3-0603]
R120  value 100K  [3-0603]
R121  value 10K  [3-0603]
R122  value 100K  [3-0603]
R123  value 10K  [3-0603]
R124  value 10K  [3-0603]
R125  value 10K  [3-0603]
R126  value 91R  [3-0603]
R127  value 91R  [3-0603]
R128  value 91R  [3-0603]
R129  value 91R  [3-0603]
R130  value 100K  [3-0603]
R131  value 100K  [3-0603]
TP74  TP  [TP]  (value not drawn)
TP75  TP  [TP]  (value not drawn)
TP76  TP  [TP]  (value not drawn)
TP77  TP  [TP]  (value not drawn)
TP78  TP  [TP]  (value not drawn)
TP79  TP  [TP]  (value not drawn)
TP80  TP  [TP]  (value not drawn)
TP81  TP  [TP]  (value not drawn)
U25  LME49726MY  [LME49726]
U26  LME49726MY  [LME49726]
U27  LME49726MY  [LME49726]
U28  LME49726MY  [LME49726]

### Blocks framed on the sheet
MIC-1 CODEC1-AN1: C109 C111 C113 C115 C117 C119 J10 R100 R102 R104 R105 R108 R110 R112 R114 TP74 TP76 U25
MIC-3 CODEC1-AN3: C110 C112 C114 C116 C118 C120 J11 R101 R103 R106 R107 R109 R111 R113 R115 TP75 TP77 U26
MIC-2 CODEC1-AN2: C121 C123 C125 C127 C129 C131 J12 R116 R118 R120 R121 R124 R126 R128 R130 TP78 TP80 U27
MIC-4 CODEC1-AN4: C122 C124 C126 C128 C130 C132 J13 R117 R119 R122 R123 R125 R127 R129 R131 TP79 TP81 U28
DECOUPLING: C141-C148

### Ports
ADC1_AIN1+ (out), ADC1_AIN1- (out), ADC1_AIN2+ (out), ADC1_AIN2- (out), ADC1_AIN3+ (out), ADC1_AIN3- (out), ADC1_AIN4+ (out), ADC1_AIN4- (out), CODEC1_VQ (in)

### Nets
+4V3: C141.2 C142.2 C143.2 C144.2 C145.2 C146.2 C147.2 C148.2 J10.1(Vcc) J11.1(Vcc) J12.1(Vcc) J13.1(Vcc) U25.8(VDD) U26.8(VDD) U27.8(VDD) U28.8(VDD)
GND: C115.1 C116.1 C127.1 C128.1 C141.1 C142.1 C143.1 C144.1 C145.1 C146.1 C147.1 C148.1 J10.3(Gnd) J11.3(Gnd) J12.3(Gnd) J13.3(Gnd) R104.1 R106.1 R114.1 R115.1 R120.1 R122.1 R130.1 R131.1 U25.4(VSS) U25.9(DAP) U26.4(VSS) U26.9(DAP) U27.4(VSS) U27.9(DAP) U28.4(VSS) U28.9(DAP)
C1_AN1_1_N: C113.2 J10.2(A-) R104.2 TP74.1
C1_AN1_1_P: C119.2 J10.4(A+) R114.2 TP76.1
C1_AN1_2_N: C113.1 R105.2 U25.5(+IN_B)
C1_AN1_2_P: C119.1 R108.1 U25.3(+IN_A)
C1_AN1_3_N: C111.1 R110.2 U25.7(OUT_B)
C1_AN1_3_P: C109.1 R112.2 U25.1(OUT_A)
C1_AN1_4_N: C117.2 R100.1 R110.1 ; port ADC1_AIN1-  [project net ADC1_AIN1_N]
C1_AN1_4_P: C117.1 R102.1 R112.1 ; port ADC1_AIN1+  [project net ADC1_AIN1_P]
C1_AN2_1_N: C125.2 J12.2(A-) R120.2 TP78.1
C1_AN2_1_P: C131.2 J12.4(A+) R130.2 TP80.1
C1_AN2_2_N: C125.1 R121.2 U27.5(+IN_B)
C1_AN2_2_P: C131.1 R124.1 U27.3(+IN_A)
C1_AN2_3_N: C123.1 R126.2 U27.7(OUT_B)
C1_AN2_3_P: C121.1 R128.2 U27.1(OUT_A)
C1_AN2_4_N: C129.2 R116.1 R126.1 ; port ADC1_AIN2-  [project net ADC1_AIN2_N]
C1_AN2_4_P: C129.1 R118.1 R128.1 ; port ADC1_AIN2+  [project net ADC1_AIN2_P]
C1_AN3_1_N: C114.2 J11.2(A-) R106.2 TP75.1
C1_AN3_1_P: C120.2 J11.4(A+) R115.2 TP77.1
C1_AN3_2_N: C114.1 R107.2 U26.5(+IN_B)
C1_AN3_2_P: C120.1 R109.1 U26.3(+IN_A)
C1_AN3_3_N: C112.1 R111.2 U26.7(OUT_B)
C1_AN3_3_P: C110.1 R113.2 U26.1(OUT_A)
C1_AN3_4_N: C118.2 R101.1 R111.1 ; port ADC1_AIN3-  [project net ADC1_AIN3_N]
C1_AN3_4_P: C118.1 R103.1 R113.1 ; port ADC1_AIN3+  [project net ADC1_AIN3_P]
C1_AN4_1_N: C126.2 J13.2(A-) R122.2 TP79.1
C1_AN4_1_P: C132.2 J13.4(A+) R131.2 TP81.1
C1_AN4_2_N: C126.1 R123.2 U28.5(+IN_B)
C1_AN4_2_P: C132.1 R125.1 U28.3(+IN_A)
C1_AN4_3_N: C124.1 R127.2 U28.7(OUT_B)
C1_AN4_3_P: C122.1 R129.2 U28.1(OUT_A)
C1_AN4_4_N: C130.2 R117.1 R127.1 ; port ADC1_AIN4-  [project net ADC1_AIN4_N]
C1_AN4_4_P: C130.1 R119.1 R129.1 ; port ADC1_AIN4+  [project net ADC1_AIN4_P]
CODEC1_VQ: C115.2 C116.2 C127.2 C128.2 R105.1 R107.1 R108.2 R109.2 R121.1 R123.1 R124.2 R125.2 ; port CODEC1_VQ
NetC109_2: C109.2 R102.2 U25.2(-IN_A)
NetC110_2: C110.2 R103.2 U26.2(-IN_A)
NetC111_2: C111.2 R100.2 U25.6(-IN_B)
NetC112_2: C112.2 R101.2 U26.6(-IN_B)
NetC121_2: C121.2 R118.2 U27.2(-IN_A)
NetC122_2: C122.2 R119.2 U28.2(-IN_A)
NetC123_2: C123.2 R116.2 U27.6(-IN_B)
NetC124_2: C124.2 R117.2 U28.6(-IN_B)

### Notes on the sheet
- Place 2700pF the closest to the ADC in parallel with AIN+ and AIN-
- Title:
- Date:
- Sheet:
- of
- Author:
- Team members:
- M.Bandou, A.Béland, G.Cayer,
- Rev.:
- Released under Creative Common Licence Attribution-ShareAlike 2.5 Canada (CC BY-SA 2.5)
- S.Choquette, F.Gosselin,
- F.Robitaillle, D.Telly.Kizito
- Info.: http://sourceforge.net/projects/eightsoundsusb/
- Design inspired by XMOS USB Audio 2.0  Mutlichannel Ref.

### Library data of the parts
C109-C112 C121-C124 = Cap: as C85 on sheet PREAMP0; Cost: 0,005
C113 C114 C119 C120 C125 C126 C131 C132 = Cap Pol1: as C45 on sheet CODEC0; Cost: *
C115 C116 C127 C128 = Cap: as C48 on sheet CODEC0; Cost: 0,005
C117 C118 C129 C130 = Cap: as C93 on sheet PREAMP0; Cost: 0,005
C141-C144 = Cap: as C7 on sheet MAIN_POWER
C145-C148 = Cap: as C36 on sheet CLOCKING; Cost: 0,005
J10 J12 = RJ-11: as J6 on sheet PREAMP0
J11 J13 = RJ-11: as J7 on sheet PREAMP0
R100-R103 R116-R119 = Res3: as R7 on sheet MAIN_POWER; Cost: *
R104 R106 R114 R115 R120 R122 R130 R131 = Res3: as R72 on sheet PREAMP0; Cost: *
R105 R107-R109 R121 R123-R125 = Res3: as R3 on sheet MAIN_POWER; Cost: *
R110-R113 R126-R129 = Res3: as R78 on sheet PREAMP0; Cost: *
U25-U27 = LME49726MY: as U21 on sheet PREAMP0; Published: 4-Dec-2008; DatasheetVersion: Nov-2008; PackageVersion: revA, Nov-2003; PackageReference: MUY08A; Publisher: Altium Limited; PackageDescription: Molded Mini-SO, Exposed Pad, .118 x .118 x .034in Body, 8 Lead, .0256in Pitch; Part Number: LME49726MY; RoHS: Y; PinCount: 8; Code_JEDEC: MO-187-AA; ComponentLink1Description: LME49726 Datasheet; ComponentLink1URL: http://www.national.com/ds/LM/LME49726.pdf; ComponentLink2Description: LME49726 Web Page; ComponentLink2URL: http://www.national.com/pf/LM/LME49726.html; ComponentLink3Description: MUY08A Package Page; ComponentLink3URL: http://www.national.com/packaging/folders/muy08a.html
U28 = LME49726MY: High Current, Low Distortion Rail-to-Rail Output Audio Operational Amplifier; Manufacturer: National Semiconductor; PackageTopMarking: ZXTT*ZA3; PowerWise: N; PackageDescription: Molded Mini-SO, Exposed Pad, .118 x .118 x .034in Body, 8 Lead, .0256in Pitch; Part Number: LME49726MY; RoHS: Y; PinCount: 8; Code_JEDEC: MO-187-AA

## Sheet XS1_SYSTEM.SchDoc: XS1 SYSTEM
size A3; Date: 2011-11-28; Author: S.Choquette; Revision: 2.0; SheetNumber: 2; SheetTotal: 9
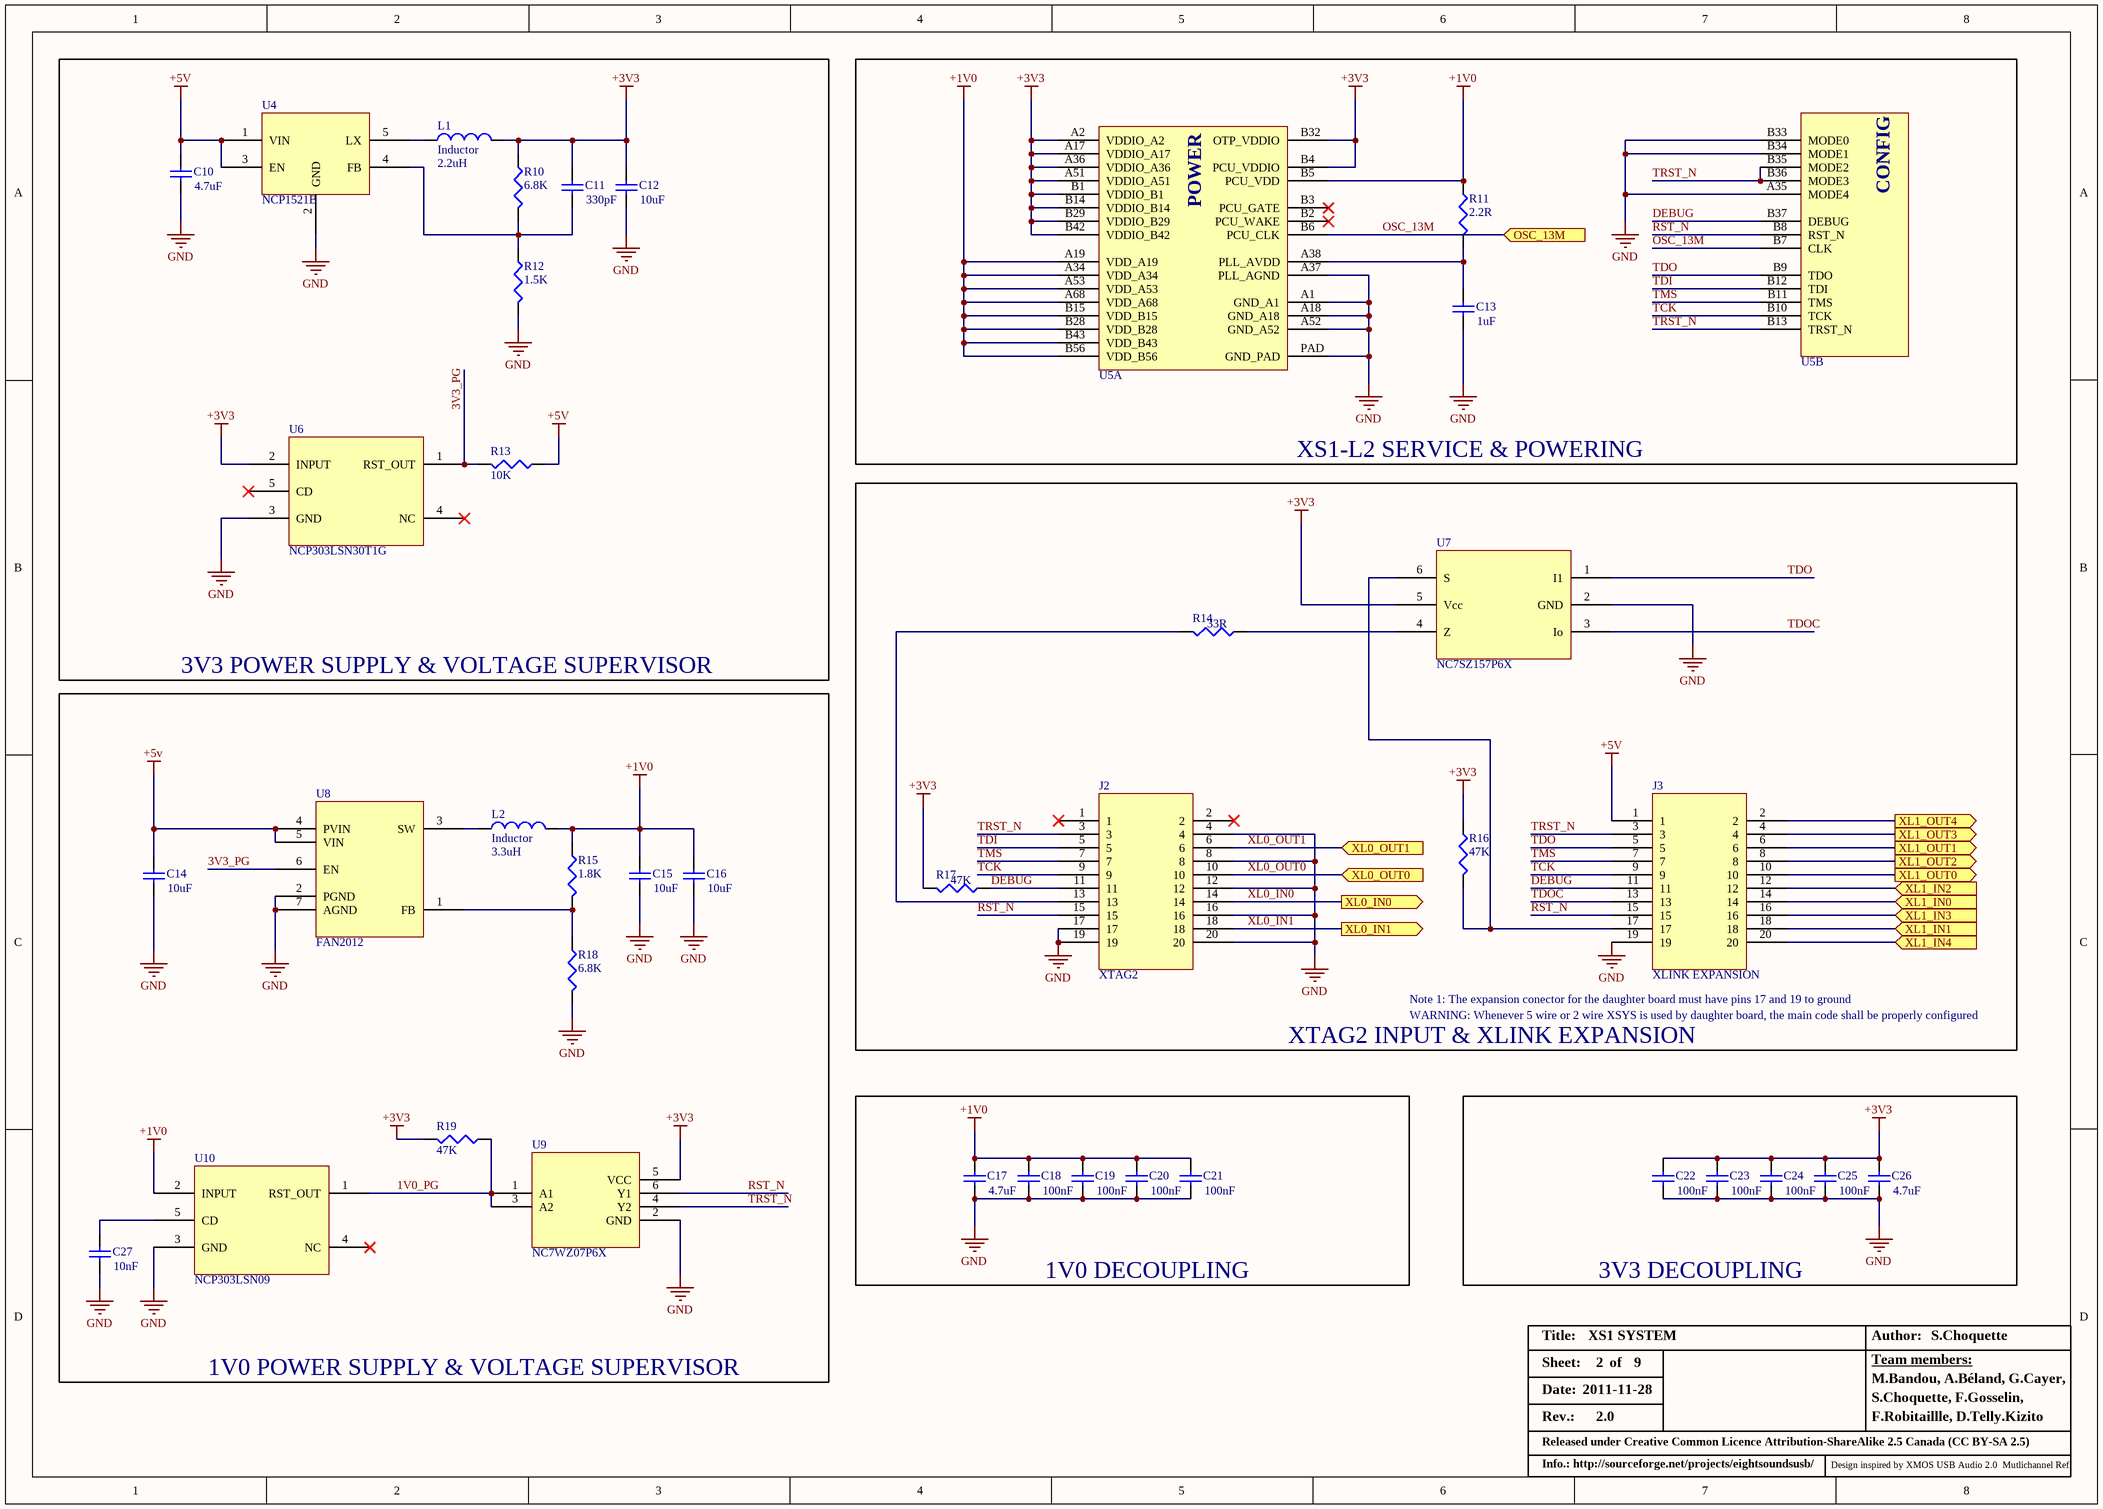
[diagram p6: XS1_SYSTEM.SchDoc]

### Parts
C10  value 4.7uF  [3-0603]
C11  value 330pF  [3-0603]
C12  value 10uF  [6-0805]
C13  value 1uF  [3-0603]
C14  value 10uF  [6-0805]
C15  value 10uF  [6-0805]
C16  value 10uF  [6-0805]
C17  value 4.7uF  [3-0603]
C18  value 100nF  [2-0402]
C19  value 100nF  [2-0402]
C20  value 100nF  [2-0402]
C21  value 100nF  [2-0402]
C22  value 100nF  [2-0402]
C23  value 100nF  [2-0402]
C24  value 100nF  [2-0402]
C25  value 100nF  [2-0402]
C26  value 4.7uF  [3-0603]
C27  value 10nF  [3-0603]
J2  XTAG2  [HEADER-2X10-100mil]
J3  XLINK EXPANSION  [HEADER-2X10-100mil_STRAIGHT]
L1  Inductor  value 2.2uH  [Inductor]
L2  Inductor  value 3.3uH  [INDUCTOR_1515]
R10  value 6.8K  [3-0603]
R11  value 2.2R  [3-0603]
R12  value 1.5K  [3-0603]
R13  value 10K  [3-0603]
R14  value 33R  [3-0603]
R15  value 1.8K  [3-0603]
R16  value 47K  [3-0603]
R17  value 47K  [3-0603]
R18  value 6.8K  [3-0603]
R19  value 47K  [3-0603]
U4  NCP1521B  [SOT23-5AL_MOD(1-07)]
U5  XS1_L2_124QFN  [QFN-124]  (value not drawn)  (parts A,B of 4)
U6  NCP303LSN30T1G  [SOT23-5AL_MOD(1-07)]
U7  NC7SZ157P6X  [SOT363-6L]
U8  FAN2012  [MLP-6-LEAD-3X3mm]
U9  NC7WZ07P6X  [SOT363-6L]
U10  NCP303LSN09  [SOT23-5AL_MOD(1-07)]

### Blocks framed on the sheet
3V3 POWER SUPPLY & VOLTAGE SUPERVISOR: C10-C12 L1 R10 R12 R13 U4 U6
XS1-L2 SERVICE & POWERING: C13 R11 U5
XTAG2 INPUT & XLINK EXPANSION: J2 J3 R14 R16 R17 U7
1V0 POWER SUPPLY & VOLTAGE SUPERVISOR: C14-C16 C27 L2 R15 R18 R19 U8-U10
1V0 DECOUPLING: C17-C21
3V3 DECOUPLING: C22-C26

### Ports
OSC_13M (in), XL0_IN0 (out), XL0_IN1 (out), XL0_OUT0 (in), XL0_OUT1 (in), XL1_IN0 (in), XL1_IN1 (in), XL1_IN2 (in), XL1_IN3 (in), XL1_IN4 (in), XL1_OUT0 (out), XL1_OUT1 (out), XL1_OUT2 (out), XL1_OUT3 (out), XL1_OUT4 (out)

### Nets
+1V0: C15.2 C16.2 C17.2 C18.2 C19.2 C20.2 C21.2 L2.2 R11.1 R15.1 U5.A19(VDD_A19) U5.A34(VDD_A34) U5.A53(VDD_A53) U5.A68(VDD_A68) U5.B5(PCU_VDD) U5.B15(VDD_B15) U5.B28(VDD_B28) U5.B43(VDD_B43) U5.B56(VDD_B56) U10.2(INPUT)
+3V3: C11.2 C12.2 C22.2 C23.2 C24.2 C25.2 C26.2 L1.2 R10.1 R16.1 R17.2 R19.2 U5.A2(VDDIO_A2) U5.A17(VDDIO_A17) U5.A36(VDDIO_A36) U5.A51(VDDIO_A51) U5.B1(VDDIO_B1) U5.B4(PCU_VDDIO) U5.B14(VDDIO_B14) U5.B29(VDDIO_B29) U5.B32(OTP_VDDIO) U5.B42(VDDIO_B42) U6.2(INPUT) U7.5(Vcc) U9.5(VCC)
+5V: C10.2 C14.2 J3.1 R13.1 U4.1(VIN) U4.3(EN) U8.4(PVIN) U8.5(VIN)
GND: C10.1 C12.1 C13.1 C14.1 C15.1 C16.1 C17.1 C18.1 C19.1 C20.1 C21.1 C22.1 C23.1 C24.1 C25.1 C26.1 C27.1 J2.4 J2.8 J2.12 J2.16 J2.17 J2.19 J2.20 J3.19 R12.2 R18.2 U4.2(GND) U5.A1(GND_A1) U5.A18(GND_A18) U5.A35(MODE4) U5.A37(PLL_AGND) U5.A52(GND_A52) U5.B33(MODE0) U5.B34(MODE1) U5.PAD(GND_PAD) U6.3(GND) U7.2(GND) U8.2(PGND) U8.7(AGND) U9.2(GND) U10.3(GND)
1V0_PG: R19.1 U9.1(A1) U9.3(A2) U10.1(RST_OUT)
3V3_PG: R13.2 U6.1(RST_OUT) U8.6(EN)
DEBUG: J2.11 J3.11 R17.1 U5.B37(DEBUG)
OSC_13M: U5.B6(PCU_CLK) U5.B7(CLK) ; port OSC_13M
RST_N: J2.15 J3.15 U5.B8(RST_N) U9.6(Y1)
TCK: J2.9 J3.9 U5.B10(TCK)
TDI: J2.5 U5.B12(TDI)
TDO: J3.5 U5.B9(TDO) U7.1(I1)
TDOC: J3.13 U7.3(Io)
TMS: J2.7 J3.7 U5.B11(TMS)
TRST_N: J2.3 J3.3 U5.B13(TRST_N) U5.B35(MODE2) U5.B36(MODE3) U9.4(Y2)
XL0_IN0: J2.14 ; port XL0_IN0
XL0_IN1: J2.18 ; port XL0_IN1
XL0_OUT0: J2.10 ; port XL0_OUT0
XL0_OUT1: J2.6 ; port XL0_OUT1
NetC11_1: C11.1 R10.2 R12.1 U4.4(FB)
NetC13_2: C13.2 R11.2 U5.A38(PLL_AVDD)
NetC27_2: C27.2 U10.5(CD)
NetJ2_13: J2.13 R14.2
NetJ3_2: J3.2 ; port XL1_OUT4
NetJ3_4: J3.4 ; port XL1_OUT3
NetJ3_6: J3.6 ; port XL1_OUT1
NetJ3_8: J3.8 ; port XL1_OUT2
NetJ3_10: J3.10 ; port XL1_OUT0
NetJ3_12: J3.12 ; port XL1_IN2
NetJ3_14: J3.14 ; port XL1_IN0
NetJ3_16: J3.16 ; port XL1_IN3
NetJ3_17: J3.17 R16.2 U7.6(S)
NetJ3_18: J3.18 ; port XL1_IN1
NetJ3_20: J3.20 ; port XL1_IN4
NetL1_1: L1.1 U4.5(LX)
NetL2_1: L2.1 U8.3(SW)
NetR14_1: R14.1 U7.4(Z)
NetR15_2: R15.2 R18.1 U8.1(FB)

Not connected (* = marked no-connect by the designer): J2 1* 2*; U5 B2(PCU_WAKE)* B3(PCU_GATE)*; U6 4(NC)* 5(CD)*; U10 4(NC)*

### Notes on the sheet
- (near J3) Note 1: The expansion conector for the daughter board must have pins 17 and 19 to ground
- WARNING: Whenever 5 wire or 2 wire XSYS is used by daughter board, the main code shall be properly configured
- Title:
- Date:
- Sheet:
- of
- Author:
- Team members:
- M.Bandou, A.Béland, G.Cayer,
- Rev.:
- Released under Creative Common Licence Attribution-ShareAlike 2.5 Canada (CC BY-SA 2.5)
- S.Choquette, F.Gosselin,
- F.Robitaillle, D.Telly.Kizito
- Info.: http://sourceforge.net/projects/eightsoundsusb/
- Design inspired by XMOS USB Audio 2.0  Mutlichannel Ref.
- (in symbol XS1_L2_124QFN, part A) POWER
- (in symbol XS1_L2_124QFN, part B) CONFIG

### Library data of the parts
C10 C17 C26 = Cap: MLCC 4.7uF 0603 X5R 6.3V; Manufacturer: Murata; Part Number: GRM188R60J475KE19; Cost: *
C11 = Cap: MLCC 330pF 0603 COG 50V; Manufacturer: Murata; Part Number: GRM1885C1H331JA01; Cost: 0,005
C12 C14-C16 = Cap: MLCC 10uF 0805 X5R 10V; Manufacturer: Murata; Part Number: GRM21BR61A106KE19; Cost: 0,005
C13 = Cap: as C1 on sheet MAIN_POWER; Cost: 0,005
C18-C25 = Cap: as C36 on sheet CLOCKING; Cost: 0,005
C27 = Cap: MLCC 10nF 0603 X7R 50V; Manufacturer: Murata; Part Number: GRM188R71H103KA01; Cost: 0,005
J2 = HEADER-2X10: IDC Boxed Header, Right Angle, PCB Mount, Polarised, 20 Way, 2x10, 0.1" Pitch; Manufacturer: Sullins; Part Number: SBH11-PBPC-D10-RA-BK; Cost: *
J3 = HEADER-2X10_STRAIGHT: IDC Header Female, Straight, PCB Mount, Polarised, 20 Way, 2x10, 0.1" Pitch; Manufacturer: Sullins; Part Number: SFH11-PBPC-D10-ST-BK
L1 = Inductor: Power Inductor, 2.2uH, 0.7A, 260mR DCR; Manufacturer: Taiyo Yuden; Part Number: CBC2016T2R2M; Code_IEC: 1005; Code_JEITA: 0402; Cost: *
L2 = Inductor: Power Inductor, 3.3uH, 1.7A, 78mR DCR; Manufacturer: Murata; Part Number: LQH44PN3R3MP0; Cost: *
R10 R18 = Res3: RES 6.8k 0603 1%; Manufacturer: ROHM; Part Number: MCR03EZPFX6801; Cost: *
R11 = Res3: RES 2.2R 0603 1%; Manufacturer: ROHM; Part Number: MCR03EZPJ2R2; Cost: *
R12 = Res3: RES 1.5k 0603 1%; Manufacturer: ROHM; Part Number: MCR03EZPFX1501; Cost: *
R13 = Res3: as R3 on sheet MAIN_POWER; Cost: *
R14 = Res3: as R41 on sheet CLOCKING; Cost: *
R15 = Res3: as R8 on sheet MAIN_POWER; Cost: *
R16 R17 R19 = Res3: RES 47k 0603 1%; Manufacturer: ROHM; Part Number: MCR03EZPFX4702; Cost: *
U4 = NCP1521B: 1.5 MHz, 600 mA Step-Down  DC-DC Converter; Manufacturer: ON Semiconductor; Part Number: NCP1521B; Cost: *
U5 = XS1_L2_124QFN: Event-driven dual-core processor XS1-L2 124QFN; Manufacturer: XMOS; Part Number: XS1-L02A-QF124-C4; Cost: *
U6 = NCP303LSN30: Voltage Detector Series with Programmable Delay; Manufacturer: ON Semiconductor; Part Number: NCP303LSN30T1G; Cost: *
U7 = NC7SZ157: TinyLogic UHS 2 Input Non-Inverting Multiplexer; Manufacturer: Fairchild; Part Number: NC7SZ157P6X; Cost: *
U8 = FAN2012: 1.5A Low Voltage Current Mode Synchronous PWM Buck  Regulator; Manufacturer: Fairchild; Part Number: FAN2012; Cost: *
U9 = NC7WZ07: TinyLogic UHS Dual Buffer; Manufacturer: Fairchild; Part Number: NC7WZ07P6X; Cost: *
U10 = NCP303LSN09: Voltage Detector Serieswith Programmable Delay; Manufacturer: ON Semiconductor; Part Number: NCP303LSN09T1G; Cost: *